# Altium project KitKTS.PrjPcb (part 2 of 3)

## Sheet 09-NORStatusLed.SchDoc
size A4; DocumentNumber: 9; SheetNumber: 9; SheetTotal: 26
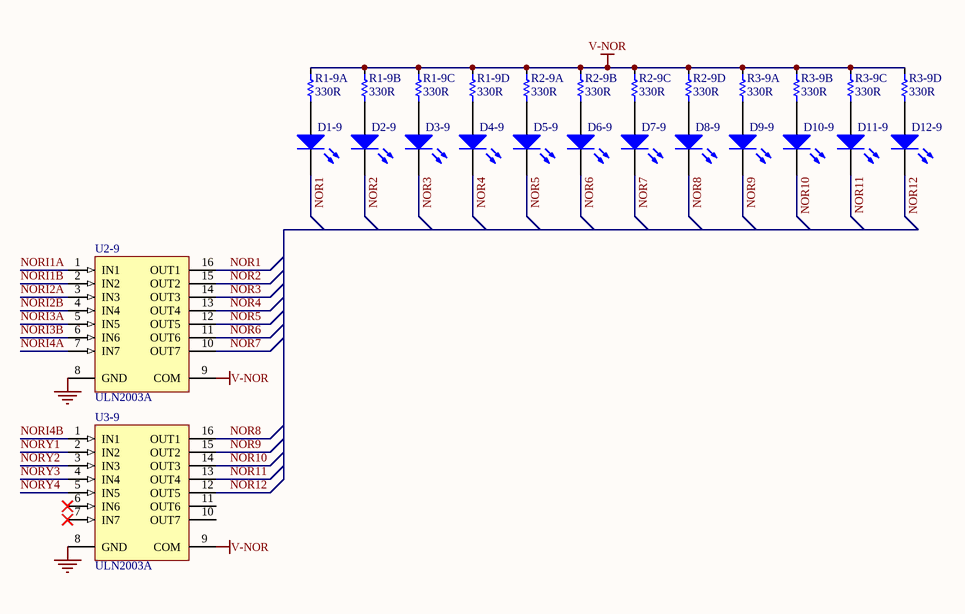
[diagram p15: 09-NORStatusLed.SchDoc]

### Parts
D1-9  LED  [LED-0805]  (value not drawn)
D2-9  LED  [LED-0805]  (value not drawn)
D3-9  LED  [LED-0805]  (value not drawn)
D4-9  LED  [LED-0805]  (value not drawn)
D5-9  LED  [LED-0805]  (value not drawn)
D6-9  LED  [LED-0805]  (value not drawn)
D7-9  LED  [LED-0805]  (value not drawn)
D8-9  LED  [LED-0805]  (value not drawn)
D9-9  LED  [LED-0805]  (value not drawn)
D10-9  LED  [LED-0805]  (value not drawn)
D11-9  LED  [LED-0805]  (value not drawn)
D12-9  LED  [LED-0805]  (value not drawn)
R1-9  330R  [R-Array-0603-4]  (parts A,B,C,D of 4)
R2-9  330R  [R-Array-0603-4]  (parts A,B,C,D of 4)
R3-9  330R  [R-Array-0603-4]  (parts A,B,C,D of 4)
U2-9  ULN2003A  [SOIC-16]
U3-9  ULN2003A  [SOIC-16]

### Nets
GND: U2-9.8(GND) U3-9.8(GND)
V-NOR: R1-9.2 R1-9.4 R1-9.6 R1-9.8 R2-9.2 R2-9.4 R2-9.6 R2-9.8 R3-9.2 R3-9.4 R3-9.6 R3-9.8 U2-9.9(COM) U3-9.9(COM)
NOR1: D1-9.2(K) U2-9.16(OUT1)
NOR2: D2-9.2(K) U2-9.15(OUT2)
NOR3: D3-9.2(K) U2-9.14(OUT3)
NOR4: D4-9.2(K) U2-9.13(OUT4)
NOR5: D5-9.2(K) U2-9.12(OUT5)
NOR6: D6-9.2(K) U2-9.11(OUT6)
NOR7: D7-9.2(K) U2-9.10(OUT7)
NOR8: D8-9.2(K) U3-9.16(OUT1)
NOR9: D9-9.2(K) U3-9.15(OUT2)
NOR10: D10-9.2(K) U3-9.14(OUT3)
NOR11: D11-9.2(K) U3-9.13(OUT4)
NOR12: D12-9.2(K) U3-9.12(OUT5)
NORI1A: U2-9.1(IN1)
NORI1B: U2-9.2(IN2)
NORI2A: U2-9.3(IN3)
NORI2B: U2-9.4(IN4)
NORI3A: U2-9.5(IN5)
NORI3B: U2-9.6(IN6)
NORI4A: U2-9.7(IN7)
NORI4B: U3-9.1(IN1)
NORY1: U3-9.2(IN2)
NORY2: U3-9.3(IN3)
NORY3: U3-9.4(IN4)
NORY4: U3-9.5(IN5)
NetD1-9_1: D1-9.1(A) R1-9.1
NetD2-9_1: D2-9.1(A) R1-9.3
NetD3-9_1: D3-9.1(A) R1-9.5
NetD4-9_1: D4-9.1(A) R1-9.7
NetD5-9_1: D5-9.1(A) R2-9.1
NetD6-9_1: D6-9.1(A) R2-9.3
NetD7-9_1: D7-9.1(A) R2-9.5
NetD8-9_1: D8-9.1(A) R2-9.7
NetD9-9_1: D9-9.1(A) R3-9.1
NetD10-9_1: D10-9.1(A) R3-9.3
NetD11-9_1: D11-9.1(A) R3-9.5
NetD12-9_1: D12-9.1(A) R3-9.7

Not connected (* = marked no-connect by the designer): U3-9 6(IN6)* 7(IN7)* 10(OUT7) 11(OUT6)

### Library data of the parts
D1-9 D2-9 D3-9 D4-9 D5-9 D6-9 D7-9 D8-9 D9-9 D10-9 D11-9 D12-9 = LED2: as D1-4 on sheet 04-ANDStatusLed; Published: 8-Jun-2000; LatestRevisionDate: 17-Jul-2002; LatestRevisionNote: Re-released for DXP Platform.; PackageVersion: Feb-2002; PackageReference: 3.2X1.6X1.1; Publisher: Altium Limited; PackageDescription: SM LED; 2 Flat Leads
R1-9 R2-9 R3-9 = Res Array 4: as R1-4 on sheet 04-ANDStatusLed; Digi-Key Part Number: Y9331TR-ND; Link: http://www.digikey.com/product-detail/en/EXB-38V331JV/Y9331TR-ND/256525
U2-9 U3-9 = ULN2003A: as U1-4 on sheet 04-ANDStatusLed; Published: 13-Oct-2000; LatestRevisionDate: 06-Jun-2005; LatestRevisionNote: Stylized 3D Model Added.; DatasheetVersion: 1998; PackageVersion: 1998; PackageReference: A16; Publisher: Altium Limited; PackageDescription: DIP; 16 Leads; Row Spacing 7.62 mm; Pitch 2.54 mm; Code_JEDEC: MS-001-BB; ComponentLink1Description: Manufacturer Link; ComponentLink1URL: http://www.allegromicro.com/

## Sheet 10-Buffer.SchDoc
size A4; DocumentNumber: 10; SheetNumber: 10; SheetTotal: 26
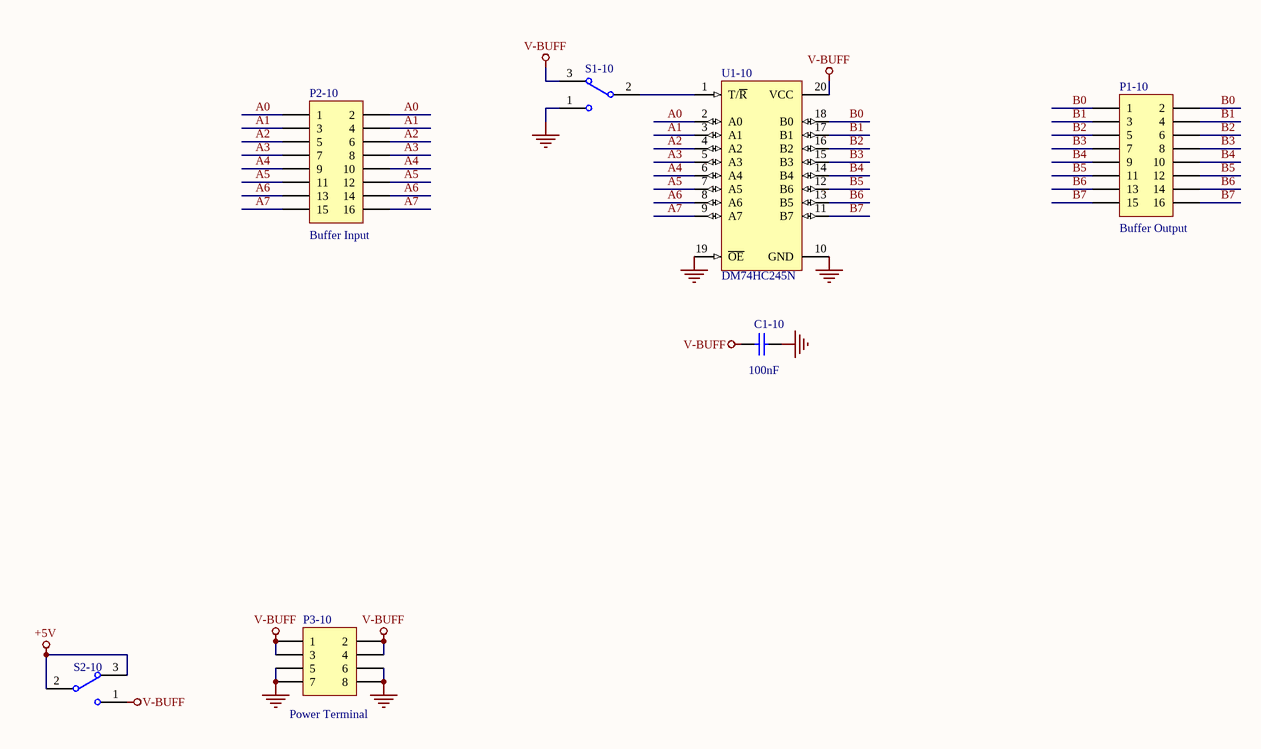
[diagram p16: 10-Buffer.SchDoc]

### Parts
C1-10  value 100nF  [c-0805]  (hidden comment: 104)
P1-10  value Buffer Output  [JP2.54-F-2x08A]  (hidden comment: Header 8X2)
P2-10  value Buffer Input  [JP2.54-F-2x08A]  (hidden comment: Header 8X2)
P3-10  Publisher: Power Terminal  [JP2.54-F-2x04A]  (hidden comment: Header 4X2)
S1-10  SW-SPDT  [SW-SLIDE-2P-2W]  (value not drawn)
S2-10  SW-SPDT  [SW-SLIDE-2P-2W]  (value not drawn)
U1-10  DM74HC245N  [SK-DIP20-300]

### Nets
+5V: S2-10.2 S2-10.3
GND: C1-10.2 P3-10.5 P3-10.6 P3-10.7 P3-10.8 S1-10.1 U1-10.10(GND) U1-10.19(~{OE})
V-BUFF: C1-10.1 P3-10.1 P3-10.2 P3-10.3 P3-10.4 S1-10.3 S2-10.1 U1-10.20(VCC)
A0: P2-10.1 P2-10.2 U1-10.2(A0)
A1: P2-10.3 P2-10.4 U1-10.3(A1)
A2: P2-10.5 P2-10.6 U1-10.4(A2)
A3: P2-10.7 P2-10.8 U1-10.5(A3)
A4: P2-10.9 P2-10.10 U1-10.6(A4)
A5: P2-10.11 P2-10.12 U1-10.7(A5)
A6: P2-10.13 P2-10.14 U1-10.8(A6)
A7: P2-10.15 P2-10.16 U1-10.9(A7)
B0: P1-10.1 P1-10.2 U1-10.18(B0)
B1: P1-10.3 P1-10.4 U1-10.17(B1)
B2: P1-10.5 P1-10.6 U1-10.16(B2)
B3: P1-10.7 P1-10.8 U1-10.15(B3)
B4: P1-10.9 P1-10.10 U1-10.14(B4)
B5: P1-10.11 P1-10.12 U1-10.12(B6)
B6: P1-10.13 P1-10.14 U1-10.13(B5)
B7: P1-10.15 P1-10.16 U1-10.11(B7)
NetS1-10_2: S1-10.2 U1-10.1(T/~{R})

### Library data of the parts
C1-10 = Cap: Capacitor; Published: 8-Jun-2000; LatestRevisionDate: 17-Jul-2002; LatestRevisionNote: Re-released for DXP Platform.; PackageReference: RAD-0.3; Publisher: Altium Limited; PackageDescription: Radial Cap, Thru-Hole; 2 Leads; 0.3 in Pin Spacing
P1-10 P2-10 = Header 8X2: Header, 8-Pin, Dual row; LatestRevisionDate: 17-Jul-2002; LatestRevisionNote: Re-released for DXP Platform.
P3-10 = Header 4X2: Header, 4-Pin, Dual row; LatestRevisionDate: 17-Jul-2002; LatestRevisionNote: Re-released for DXP Platform.
S1-10 S2-10 = SW-SPDT: as S1-2 on sheet 02-PowerSupply; Published: 24-Mar-1999; LatestRevisionDate: 17-Dec-2003; LatestRevisionNote: Schematic revised, PCB Footprint replaced.; DatasheetVersion: 05-Dec-2000; PackageReference: TL36WW15050; Publisher: Altium Limited; PackageDescription: Switch; 4 Leads; ComponentLink1Description: Manufacturer Link; ComponentLink1URL: http://www.apem.com
U1-10 = DM74LS245N: 3-State Octal Bus Transceiver; Published: 17-Jul-2002; LatestRevisionDate: 04-Mar-2005; LatestRevisionNote: Stylized 3D Model Added.; DatasheetVersion: Mar-1998; PackageVersion: 2000; PackageReference: N20A; Publisher: Altium Limited; PackageDescription: DIP, 20-Pin, Row Spacing 7.62 mm, Pitch 2.54 mm; Code_JEDEC: MS-001-AD; ComponentLink1Description: Manufacturer Link; ComponentLink1URL: http://www.fairchildsemi.com/

## Sheet 11-DFlipFlop.SchDoc
size A4; DocumentNumber: 11; SheetNumber: 11; SheetTotal: 26
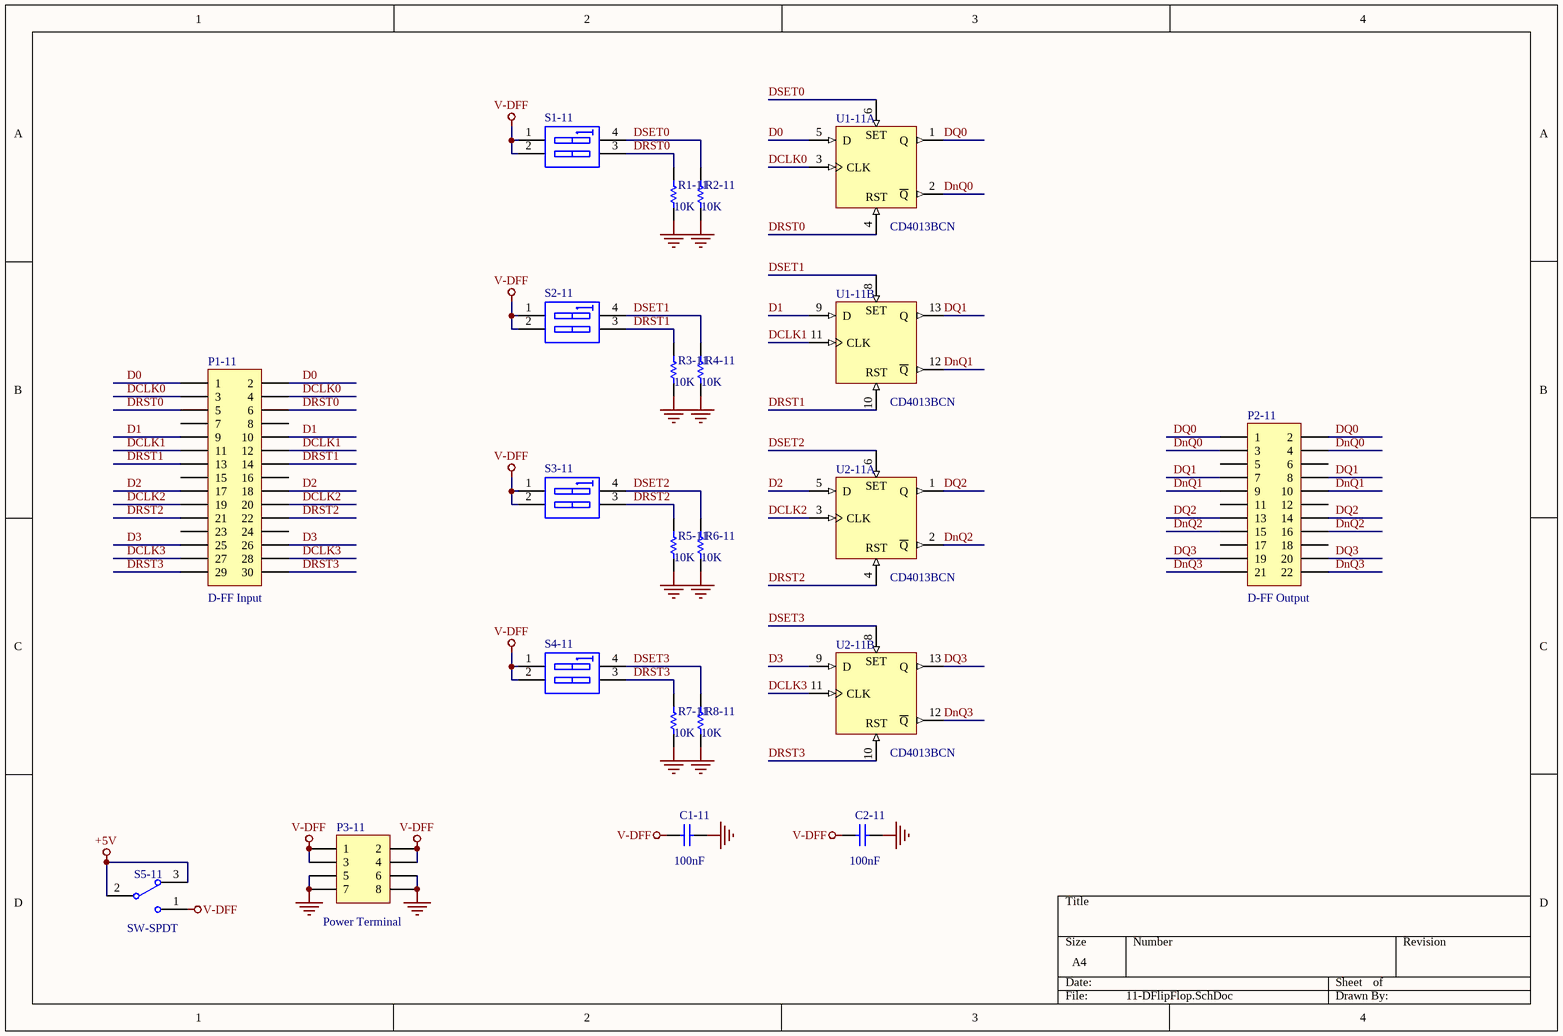
[diagram p17: 11-DFlipFlop.SchDoc]

### Parts
C1-11  value 100nF  [c-0805]  (hidden comment: 104)
C2-11  value 100nF  [c-0805]  (hidden comment: 104)
P1-11  value D-FF Input  [JP2.54-F-2x15A]  (hidden comment: Header 15X2)
P2-11  value D-FF Output  [JP2.54-F-2x11A]  (hidden comment: Header 11X2)
P3-11  Publisher: Power Terminal  [JP2.54-F-2x04A]  (hidden comment: Header 4X2)
R1-11  10K  [R-0805]
R2-11  10K  [R-0805]
R3-11  10K  [R-0805]
R4-11  10K  [R-0805]
R5-11  10K  [R-0805]
R6-11  10K  [R-0805]
R7-11  10K  [R-0805]
R8-11  10K  [R-0805]
S1-11  SW DIP-2  [SW-DIP2-SMD]  (value not drawn)
S2-11  SW DIP-2  [SW-DIP2-SMD]  (value not drawn)
S3-11  SW DIP-2  [SW-DIP2-SMD]  (value not drawn)
S4-11  SW DIP-2  [SW-DIP2-SMD]  (value not drawn)
S5-11  SW-SPDT  [SW-SLIDE-2P-2W]
U1-11  CD4013BCN  [SK-DIP14-300]  (parts A,B of 2)
U2-11  CD4013BCN  [SK-DIP14-300]  (parts A,B of 2)

### Nets
+5V: S5-11.2 S5-11.3
GND: C1-11.2 C2-11.2 P3-11.5 P3-11.6 P3-11.7 P3-11.8 R1-11.1 R2-11.1 R3-11.1 R4-11.1 R5-11.1 R6-11.1 R7-11.1 R8-11.1 U1-11.7(GND) U2-11.7(GND)
V-DFF: C1-11.1 C2-11.1 P3-11.1 P3-11.2 P3-11.3 P3-11.4 S1-11.1(A1) S1-11.2(A2) S2-11.1(A1) S2-11.2(A2) S3-11.1(A1) S3-11.2(A2) S4-11.1(A1) S4-11.2(A2) S5-11.1
VDD: U1-11.14(V-DFF) U2-11.14(V-DFF)
D0: P1-11.1 P1-11.2 U1-11.5(D)
D1: P1-11.9 P1-11.10 U1-11.9(D)
D2: P1-11.17 P1-11.18 U2-11.5(D)
D3: P1-11.25 P1-11.26 U2-11.9(D)
DCLK0: P1-11.3 P1-11.4 U1-11.3(CLK)
DCLK1: P1-11.11 P1-11.12 U1-11.11(CLK)
DCLK2: P1-11.19 P1-11.20 U2-11.3(CLK)
DCLK3: P1-11.27 P1-11.28 U2-11.11(CLK)
DnQ0: P2-11.3 P2-11.4 U1-11.2(~{Q})
DnQ1: P2-11.9 P2-11.10 U1-11.12(~{Q})
DnQ2: P2-11.15 P2-11.16 U2-11.2(~{Q})
DnQ3: P2-11.21 P2-11.22 U2-11.12(~{Q})
DQ0: P2-11.1 P2-11.2 U1-11.1(Q)
DQ1: P2-11.7 P2-11.8 U1-11.13(Q)
DQ2: P2-11.13 P2-11.14 U2-11.1(Q)
DQ3: P2-11.19 P2-11.20 U2-11.13(Q)
DRST0: P1-11.5 P1-11.6 R1-11.2 S1-11.3(B2) U1-11.4(RST)
DRST1: P1-11.13 P1-11.14 R3-11.2 S2-11.3(B2) U1-11.10(RST)
DRST2: P1-11.21 P1-11.22 R5-11.2 S3-11.3(B2) U2-11.4(RST)
DRST3: P1-11.29 P1-11.30 R7-11.2 S4-11.3(B2) U2-11.10(RST)
DSET0: R2-11.2 S1-11.4(B1) U1-11.6(S)
DSET1: R4-11.2 S2-11.4(B1) U1-11.8(S)
DSET2: R6-11.2 S3-11.4(B1) U2-11.6(S)
DSET3: R8-11.2 S4-11.4(B1) U2-11.8(S)

Not connected (* = marked no-connect by the designer): P1-11 7 8 15 16 23 24; P2-11 5 6 11 12 17 18

### Notes on the sheet
- (in symbol CD4013BCN, part A) SET
- (in symbol CD4013BCN, part B) SET

### Library data of the parts
C1-11 C2-11 = Cap: Capacitor; Published: 8-Jun-2000; LatestRevisionDate: 17-Jul-2002; LatestRevisionNote: Re-released for DXP Platform.; PackageReference: RAD-0.3; Publisher: Altium Limited; PackageDescription: Radial Cap, Thru-Hole; 2 Leads; 0.3 in Pin Spacing
P1-11 = Header 15X2: Header, 15-Pin, Dual row; LatestRevisionDate: 17-Jul-2002; LatestRevisionNote: Re-released for DXP Platform.
P2-11 = Header 11X2: Header, 11-Pin, Dual row; LatestRevisionDate: 17-Jul-2002; LatestRevisionNote: Re-released for DXP Platform.
P3-11 = Header 4X2: Header, 4-Pin, Dual row; LatestRevisionDate: 17-Jul-2002; LatestRevisionNote: Re-released for DXP Platform.
R1-11 R2-11 R3-11 R4-11 R5-11 R6-11 R7-11 R8-11 = Res1: Resistor; Published: 8-Jun-2000; LatestRevisionDate: 17-Jul-2002; LatestRevisionNote: Re-released for DXP Platform.; PackageReference: AXIAL-0.3; Publisher: Altium Limited; PackageDescription: Axial Device, Thru-Hole; 2 Leads; 0.3 in Pin Spacing; Value: 10K
S1-11 S2-11 S3-11 S4-11 = SW DIP-2: DIP Switch, 2 Position, SPST; Published: 24-Mar-1999; LatestRevisionDate: 17-Jul-2002; LatestRevisionNote: Re-released for DXP Platform.; PackageReference: DIP-4; Publisher: Altium Limited
S5-11 = SW-SPDT: as S1-2 on sheet 02-PowerSupply; Published: 24-Mar-1999; LatestRevisionDate: 17-Dec-2003; LatestRevisionNote: Schematic revised, PCB Footprint replaced.; DatasheetVersion: 05-Dec-2000; PackageReference: TL36WW15050; Publisher: Altium Limited; PackageDescription: Switch; 4 Leads; ComponentLink1Description: Manufacturer Link; ComponentLink1URL: http://www.apem.com
U1-11 U2-11 = CD4013BCN: Dual D-Type Flip-Flop; Published: 17-Jul-2002; LatestRevisionDate: 29-May-2009; LatestRevisionNote: Component Body Added.; DatasheetVersion: Jan-1999; PackageVersion: 2000; PackageReference: N14A; Publisher: Altium Limited; PackageDescription: DIP, 14-Pin, Row Spacing 7.62 mm, Pitch 2.54 mm; ComponentLink1Description: Manufacturer Link; ComponentLink1URL: http://www.fairchildsemi.com/

## Sheet 12-JKFlipFlop.SchDoc
size A4; DocumentNumber: 12; SheetNumber: 12; SheetTotal: 26
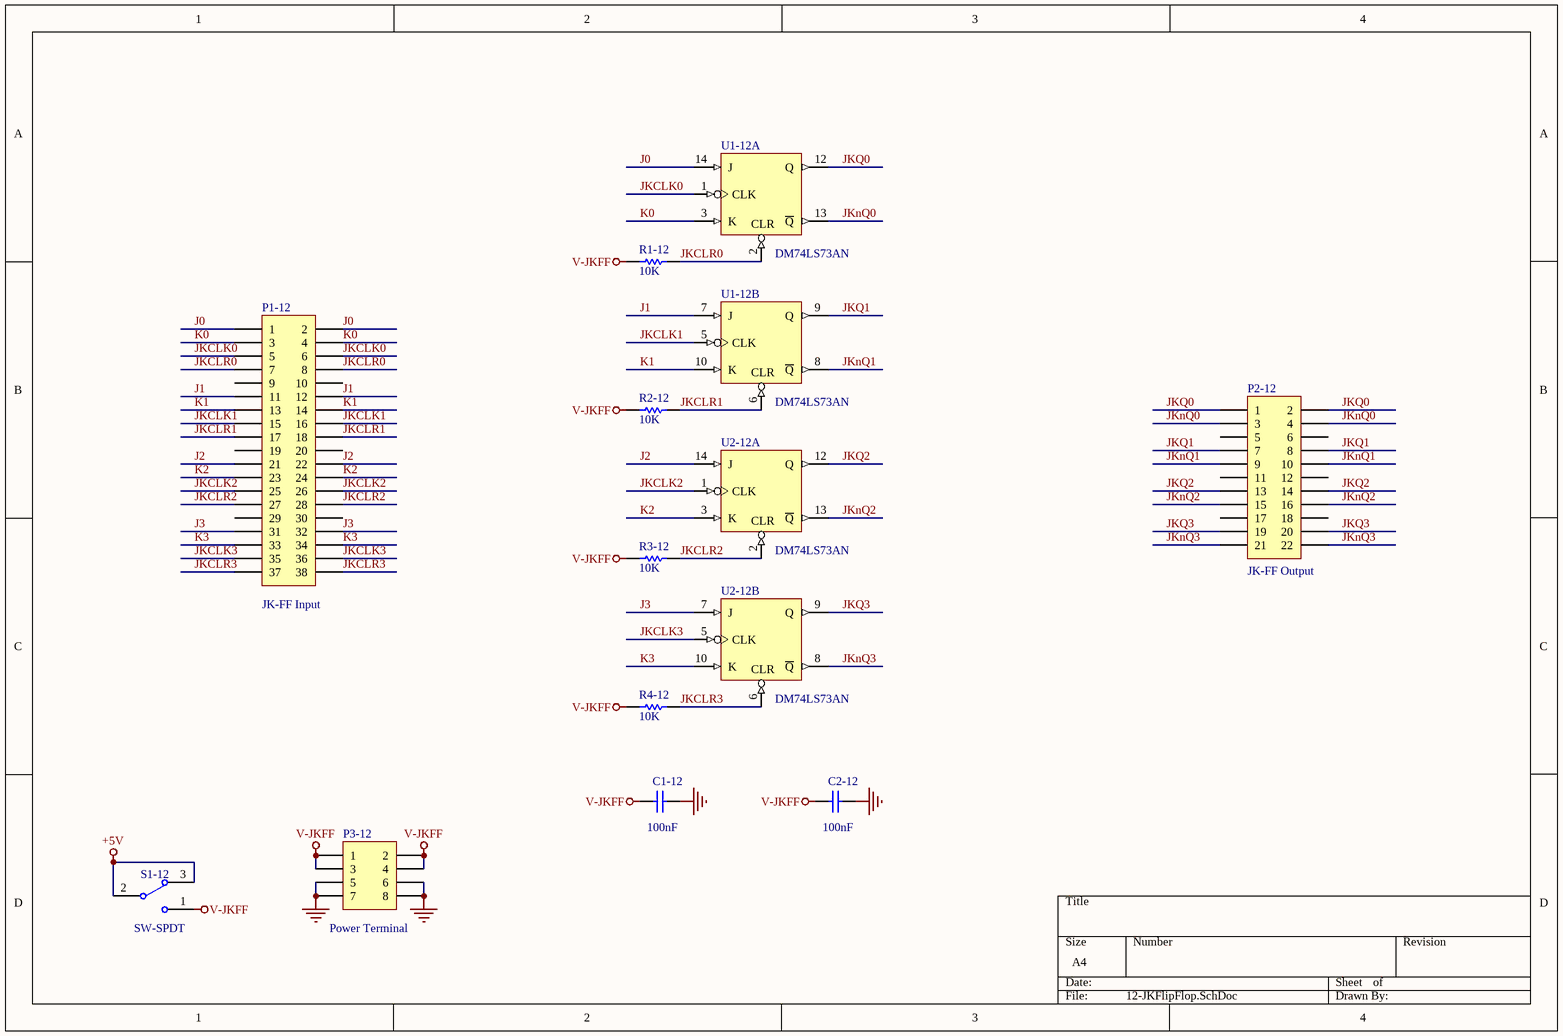
[diagram p18: 12-JKFlipFlop.SchDoc]

### Parts
C1-12  value 100nF  [c-0805]  (hidden comment: 104)
C2-12  value 100nF  [c-0805]  (hidden comment: 104)
P1-12  value JK-FF Input  [JP2.54-F-2x19A]  (hidden comment: Header 19X2)
P2-12  value JK-FF Output  [JP2.54-F-2x11A]  (hidden comment: Header 11X2)
P3-12  Publisher: Power Terminal  [JP2.54-F-2x04A]  (hidden comment: Header 4X2)
R1-12  10K  [R-0805]
R2-12  10K  [R-0805]
R3-12  10K  [R-0805]
R4-12  10K  [R-0805]
S1-12  SW-SPDT  [SW-SLIDE-2P-2W]
U1-12  DM74LS73AN  [SK-DIP14-300]  (parts A,B of 2)
U2-12  DM74LS73AN  [SK-DIP14-300]  (parts A,B of 2)

### Nets
+5V: S1-12.2 S1-12.3
GND: C1-12.2 C2-12.2 P3-12.5 P3-12.6 P3-12.7 P3-12.8 U1-12.11(GND) U2-12.11(GND)
V-JKFF: C1-12.1 C2-12.1 P3-12.1 P3-12.2 P3-12.3 P3-12.4 R1-12.2 R2-12.2 R3-12.2 R4-12.2 S1-12.1
VCC: U1-12.4(V-JKFF) U2-12.4(V-JKFF)
J0: P1-12.1 P1-12.2 U1-12.14(J)
J1: P1-12.11 P1-12.12 U1-12.7(J)
J2: P1-12.21 P1-12.22 U2-12.14(J)
J3: P1-12.31 P1-12.32 U2-12.7(J)
JKCLK0: P1-12.5 P1-12.6 U1-12.1(CLK)
JKCLK1: P1-12.15 P1-12.16 U1-12.5(CLK)
JKCLK2: P1-12.25 P1-12.26 U2-12.1(CLK)
JKCLK3: P1-12.35 P1-12.36 U2-12.5(CLK)
JKCLR0: P1-12.7 P1-12.8 R1-12.1 U1-12.2(CLR)
JKCLR1: P1-12.17 P1-12.18 R2-12.1 U1-12.6(CLR)
JKCLR2: P1-12.27 P1-12.28 R3-12.1 U2-12.2(CLR)
JKCLR3: P1-12.37 P1-12.38 R4-12.1 U2-12.6(CLR)
JKnQ0: P2-12.3 P2-12.4 U1-12.13(~{Q})
JKnQ1: P2-12.9 P2-12.10 U1-12.8(~{Q})
JKnQ2: P2-12.15 P2-12.16 U2-12.13(~{Q})
JKnQ3: P2-12.21 P2-12.22 U2-12.8(~{Q})
JKQ0: P2-12.1 P2-12.2 U1-12.12(Q)
JKQ1: P2-12.7 P2-12.8 U1-12.9(Q)
JKQ2: P2-12.13 P2-12.14 U2-12.12(Q)
JKQ3: P2-12.19 P2-12.20 U2-12.9(Q)
K0: P1-12.3 P1-12.4 U1-12.3(K)
K1: P1-12.13 P1-12.14 U1-12.10(K)
K2: P1-12.23 P1-12.24 U2-12.3(K)
K3: P1-12.33 P1-12.34 U2-12.10(K)

Not connected (* = marked no-connect by the designer): P1-12 9 10 19 20 29 30; P2-12 5 6 11 12 17 18

### Library data of the parts
C1-12 C2-12 = Cap: Capacitor; Published: 8-Jun-2000; LatestRevisionDate: 17-Jul-2002; LatestRevisionNote: Re-released for DXP Platform.; PackageReference: RAD-0.3; Publisher: Altium Limited; PackageDescription: Radial Cap, Thru-Hole; 2 Leads; 0.3 in Pin Spacing
P1-12 = Header 19X2: Header, 19-Pin, Dual row; LatestRevisionDate: 17-Jul-2002; LatestRevisionNote: Re-released for DXP Platform.
P2-12 = Header 11X2: Header, 11-Pin, Dual row; LatestRevisionDate: 17-Jul-2002; LatestRevisionNote: Re-released for DXP Platform.
P3-12 = Header 4X2: Header, 4-Pin, Dual row; LatestRevisionDate: 17-Jul-2002; LatestRevisionNote: Re-released for DXP Platform.
R1-12 R2-12 R3-12 R4-12 = Res1: Resistor; Published: 8-Jun-2000; LatestRevisionDate: 17-Jul-2002; LatestRevisionNote: Re-released for DXP Platform.; PackageReference: AXIAL-0.3; Publisher: Altium Limited; PackageDescription: Axial Device, Thru-Hole; 2 Leads; 0.3 in Pin Spacing; Value: 10K
S1-12 = SW-SPDT: as S1-2 on sheet 02-PowerSupply; Published: 24-Mar-1999; LatestRevisionDate: 17-Dec-2003; LatestRevisionNote: Schematic revised, PCB Footprint replaced.; DatasheetVersion: 05-Dec-2000; PackageReference: TL36WW15050; Publisher: Altium Limited; PackageDescription: Switch; 4 Leads; ComponentLink1Description: Manufacturer Link; ComponentLink1URL: http://www.apem.com
U1-12 U2-12 = DM74LS73AN: Dual Negative-Edge-Triggered Master-Slave J-K Flip-Flop with Clear and Complementary Output; Published: 17-Jul-2002; LatestRevisionDate: 29-May-2009; LatestRevisionNote: Component Body Added.; DatasheetVersion: Mar-1998; PackageVersion: 2000; PackageReference: N14A; Publisher: Altium Limited; PackageDescription: DIP, 14-Pin, Row Spacing 7.62 mm, Pitch 2.54 mm; ComponentLink1Description: Manufacturer Link; ComponentLink1URL: http://www.fairchildsemi.com/

## Sheet 13-Counter74LS90.SchDoc
size A4; DocumentNumber: 13; SheetNumber: 13; SheetTotal: 26
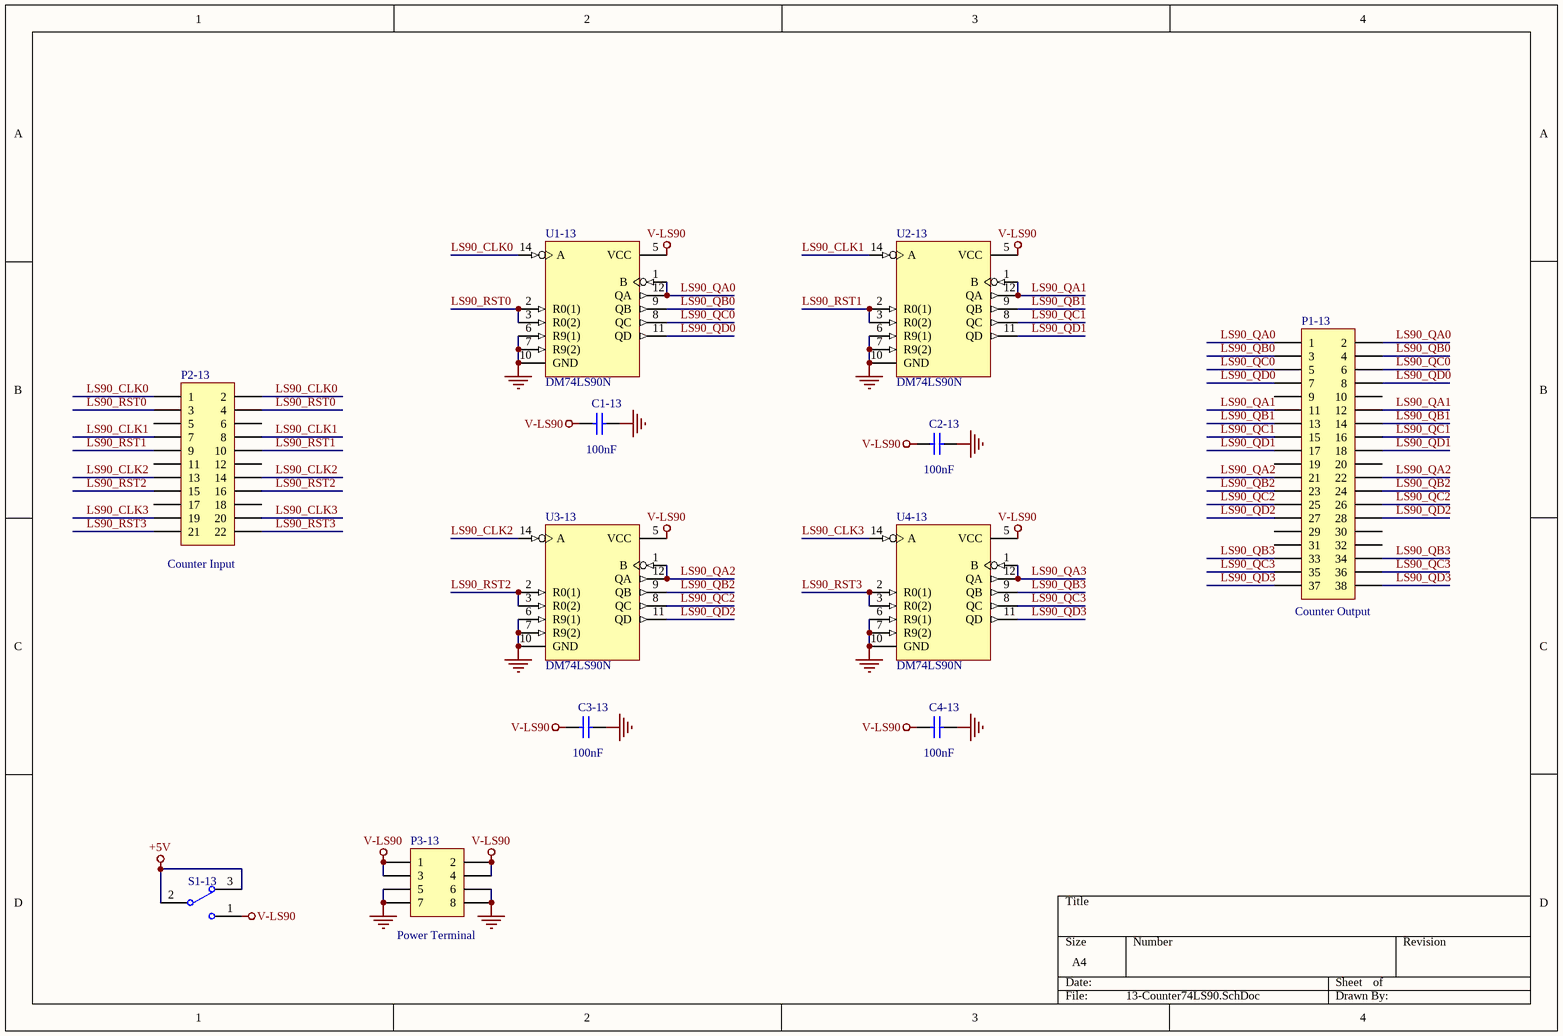
[diagram p19: 13-Counter74LS90.SchDoc]

### Parts
C1-13  value 100nF  [c-0805]  (hidden comment: 104)
C2-13  value 100nF  [c-0805]  (hidden comment: 104)
C3-13  value 100nF  [c-0805]  (hidden comment: 104)
C4-13  value 100nF  [c-0805]  (hidden comment: 104)
P1-13  value Counter Output  [JP2.54-F-2x19A]  (hidden comment: Header 19X2)
P2-13  value Counter Input  [JP2.54-F-2x11A]  (hidden comment: Header 11X2)
P3-13  Publisher: Power Terminal  [JP2.54-F-2x04A]  (hidden comment: Header 4X2)
S1-13  SW-SPDT  [SW-SLIDE-2P-2W]  (value not drawn)
U1-13  DM74LS90N  [SK-DIP14-300]
U2-13  DM74LS90N  [SK-DIP14-300]
U3-13  DM74LS90N  [SK-DIP14-300]
U4-13  DM74LS90N  [SK-DIP14-300]

### Nets
+5V: S1-13.2 S1-13.3
GND: C1-13.2 C2-13.2 C3-13.2 C4-13.2 P3-13.5 P3-13.6 P3-13.7 P3-13.8 U1-13.6(R9(1)) U1-13.7(R9(2)) U1-13.10(GND) U2-13.6(R9(1)) U2-13.7(R9(2)) U2-13.10(GND) U3-13.6(R9(1)) U3-13.7(R9(2)) U3-13.10(GND) U4-13.6(R9(1)) U4-13.7(R9(2)) U4-13.10(GND)
V-LS90: C1-13.1 C2-13.1 C3-13.1 C4-13.1 P3-13.1 P3-13.2 P3-13.3 P3-13.4 S1-13.1 U1-13.5(VCC) U2-13.5(VCC) U3-13.5(VCC) U4-13.5(VCC)
LS90_CLK0: P2-13.1 P2-13.2 U1-13.14(A)
LS90_CLK1: P2-13.7 P2-13.8 U2-13.14(A)
LS90_CLK2: P2-13.13 P2-13.14 U3-13.14(A)
LS90_CLK3: P2-13.19 P2-13.20 U4-13.14(A)
LS90_QA0: P1-13.1 P1-13.2 U1-13.1(B) U1-13.12(QA)
LS90_QA1: P1-13.11 P1-13.12 U2-13.1(B) U2-13.12(QA)
LS90_QA2: P1-13.21 P1-13.22 U3-13.1(B) U3-13.12(QA)
LS90_QA3: U4-13.1(B) U4-13.12(QA)
LS90_QB0: P1-13.3 P1-13.4 U1-13.9(QB)
LS90_QB1: P1-13.13 P1-13.14 U2-13.9(QB)
LS90_QB2: P1-13.23 P1-13.24 U3-13.9(QB)
LS90_QB3: P1-13.33 P1-13.34 U4-13.9(QB)
LS90_QC0: P1-13.5 P1-13.6 U1-13.8(QC)
LS90_QC1: P1-13.15 P1-13.16 U2-13.8(QC)
LS90_QC2: P1-13.25 P1-13.26 U3-13.8(QC)
LS90_QC3: P1-13.35 P1-13.36 U4-13.8(QC)
LS90_QD0: P1-13.7 P1-13.8 U1-13.11(QD)
LS90_QD1: P1-13.17 P1-13.18 U2-13.11(QD)
LS90_QD2: P1-13.27 P1-13.28 U3-13.11(QD)
LS90_QD3: P1-13.37 P1-13.38 U4-13.11(QD)
LS90_RST0: P2-13.3 P2-13.4 U1-13.2(R0(1)) U1-13.3(R0(2))
LS90_RST1: P2-13.9 P2-13.10 U2-13.2(R0(1)) U2-13.3(R0(2))
LS90_RST2: P2-13.15 P2-13.16 U3-13.2(R0(1)) U3-13.3(R0(2))
LS90_RST3: P2-13.21 P2-13.22 U4-13.2(R0(1)) U4-13.3(R0(2))

Not connected (* = marked no-connect by the designer): P1-13 9 10 19 20 29 30 31 32; P2-13 5 6 11 12 17 18

### Library data of the parts
C1-13 C2-13 C3-13 C4-13 = Cap: Capacitor; Published: 8-Jun-2000; LatestRevisionDate: 17-Jul-2002; LatestRevisionNote: Re-released for DXP Platform.; PackageReference: RAD-0.3; Publisher: Altium Limited; PackageDescription: Radial Cap, Thru-Hole; 2 Leads; 0.3 in Pin Spacing
P1-13 = Header 19X2: Header, 19-Pin, Dual row; LatestRevisionDate: 17-Jul-2002; LatestRevisionNote: Re-released for DXP Platform.
P2-13 = Header 11X2: Header, 11-Pin, Dual row; LatestRevisionDate: 17-Jul-2002; LatestRevisionNote: Re-released for DXP Platform.
P3-13 = Header 4X2: Header, 4-Pin, Dual row; LatestRevisionDate: 17-Jul-2002; LatestRevisionNote: Re-released for DXP Platform.
S1-13 = SW-SPDT: as S1-2 on sheet 02-PowerSupply; Published: 24-Mar-1999; LatestRevisionDate: 17-Dec-2003; LatestRevisionNote: Schematic revised, PCB Footprint replaced.; DatasheetVersion: 05-Dec-2000; PackageReference: TL36WW15050; Publisher: Altium Limited; PackageDescription: Switch; 4 Leads; ComponentLink1Description: Manufacturer Link; ComponentLink1URL: http://www.apem.com
U1-13 U2-13 U3-13 U4-13 = DM74LS90N: Decade and Binary Counter; Note: NC pins 4 and 13 are not drawn.; Published: 17-Jul-2002; LatestRevisionDate: 29-May-2009; LatestRevisionNote: Component Body Added.; DatasheetVersion: Mar-1998; PackageVersion: 2000; PackageReference: N14A; Publisher: Altium Limited; PackageDescription: DIP, 14-Pin, Row Spacing 7.62 mm, Pitch 2.54 mm; ComponentLink1Description: Manufacturer Link; ComponentLink1URL: http://www.fairchildsemi.com/

## Sheet 14-Counter74LS192.SchDoc
size A4; DocumentNumber: 14; SheetNumber: 14; SheetTotal: 26
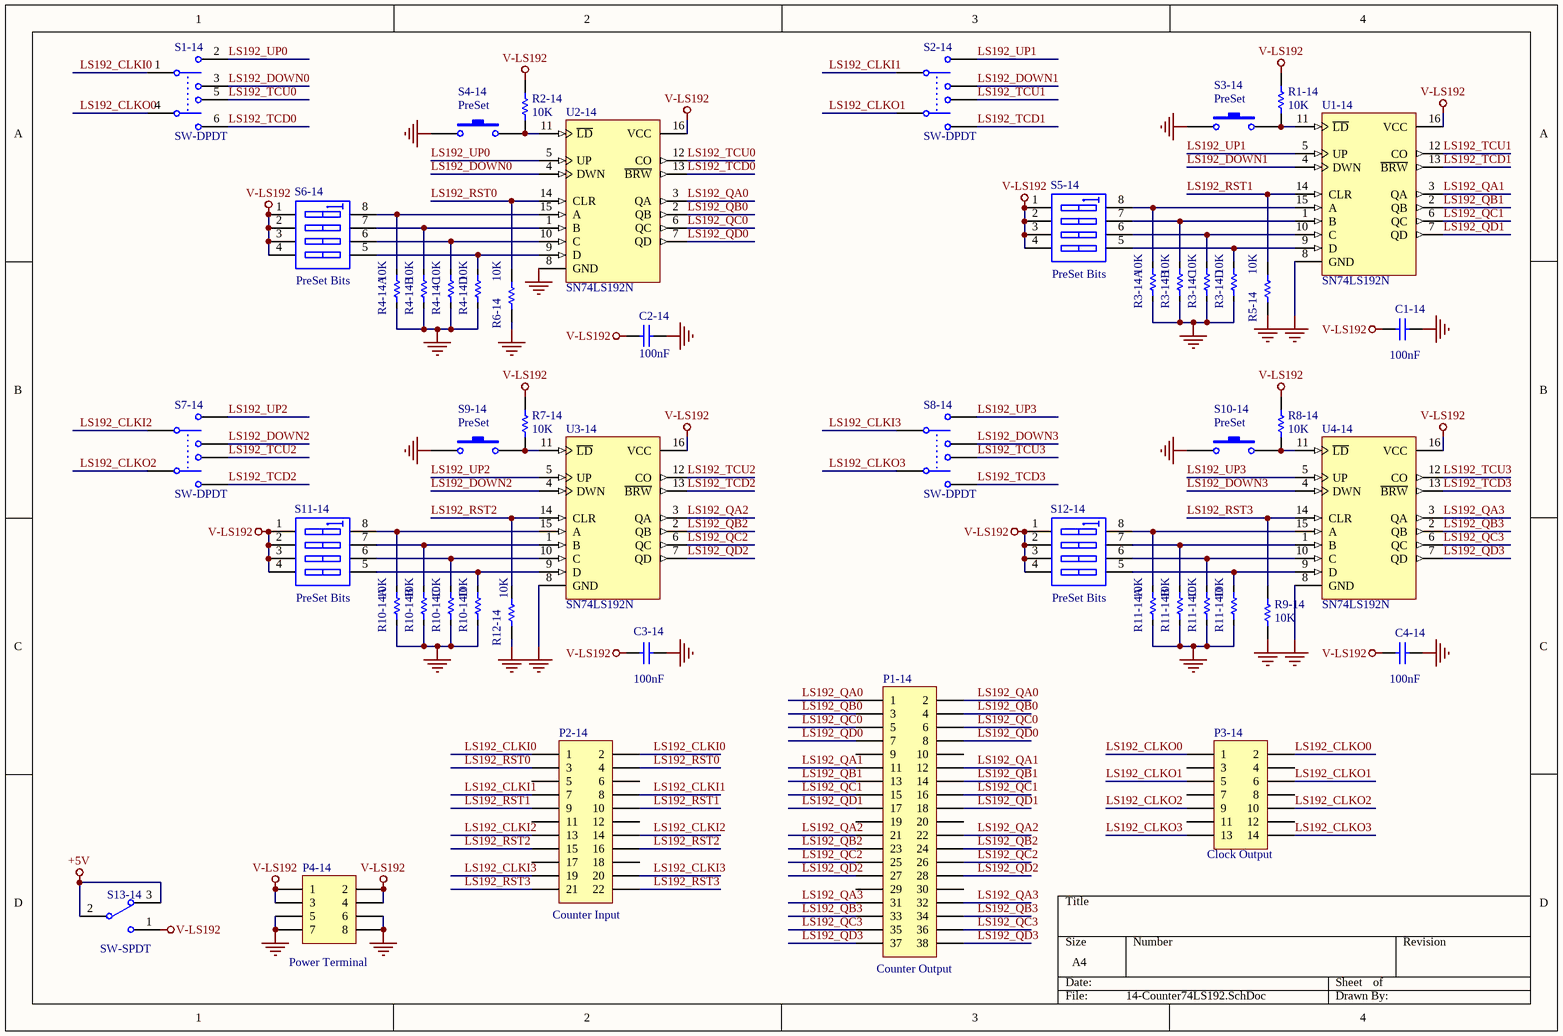
[diagram p20: 14-Counter74LS192.SchDoc]

### Parts
C1-14  value 100nF  [c-0805]  (hidden comment: 104)
C2-14  value 100nF  [c-0805]  (hidden comment: 104)
C3-14  value 100nF  [c-0805]  (hidden comment: 104)
C4-14  value 100nF  [c-0805]  (hidden comment: 104)
P1-14  value Counter Output  [JP2.54-F-2x19A]  (hidden comment: Header 19X2)
P2-14  value Counter Input  [JP2.54-F-2x11A]  (hidden comment: Header 11X2)
P3-14  value Clock Output  [JP2.54-F-2x07A]  (hidden comment: Header 7X2)
P4-14  Publisher: Power Terminal  [JP2.54-F-2x04A]  (hidden comment: Header 4X2)
R1-14  10K  [R-0805]
R2-14  10K  [R-0805]
R3-14  10K  [R-Array-0603-4]  (parts A,B,C,D of 4)
R4-14  10K  [R-Array-0603-4]  (parts A,B,C,D of 4)
R5-14  10K  [R-0805]
R6-14  10K  [R-0805]
R7-14  10K  [R-0805]
R8-14  10K  [R-0805]
R9-14  10K  [R-0805]
R10-14  10K  [R-Array-0603-4]  (parts A,B,C,D of 4)
R11-14  10K  [R-Array-0603-4]  (parts A,B,C,D of 4)
R12-14  10K  [R-0805]
S1-14  SW-DPDT  [DPDT-6]
S2-14  SW-DPDT  [DPDT-6]
S3-14  value PreSet  [SW-T-S6-SMD]  (hidden comment: SW-S6)
S4-14  value PreSet  [SW-T-S6-SMD]  (hidden comment: SW-S6)
S5-14  value PreSet Bits  [SW-DIP4-SMD]  (hidden comment: SW DIP-4)
S6-14  value PreSet Bits  [SW-DIP4-SMD]  (hidden comment: SW DIP-4)
S7-14  SW-DPDT  [DPDT-6]
S8-14  SW-DPDT  [DPDT-6]
S9-14  value PreSet  [SW-T-S6-SMD]  (hidden comment: SW-S6)
S10-14  value PreSet  [SW-T-S6-SMD]  (hidden comment: SW-S6)
S11-14  value PreSet Bits  [SW-DIP4-SMD]  (hidden comment: SW DIP-4)
S12-14  value PreSet Bits  [SW-DIP4-SMD]  (hidden comment: SW DIP-4)
S13-14  SW-SPDT  [SW-SLIDE-2P-2W]
U1-14  SN74LS192N  [SK-DIP16-300]
U2-14  SN74LS192N  [SK-DIP16-300]
U3-14  SN74LS192N  [SK-DIP16-300]
U4-14  SN74LS192N  [SK-DIP16-300]

### Nets
+5V: S13-14.2 S13-14.3
GND: C1-14.2 C2-14.2 C3-14.2 C4-14.2 P4-14.5 P4-14.6 P4-14.7 P4-14.8 R3-14.1 R3-14.3 R3-14.5 R3-14.7 R4-14.1 R4-14.3 R4-14.5 R4-14.7 R5-14.1 R6-14.1 R9-14.1 R10-14.1 R10-14.3 R10-14.5 R10-14.7 R11-14.1 R11-14.3 R11-14.5 R11-14.7 R12-14.1 S3-14.1 S4-14.1 S9-14.1 S10-14.1 U1-14.8(GND) U2-14.8(GND) U3-14.8(GND) U4-14.8(GND)
V-LS192: C1-14.1 C2-14.1 C3-14.1 C4-14.1 P4-14.1 P4-14.2 P4-14.3 P4-14.4 R1-14.2 R2-14.2 R7-14.2 R8-14.2 S5-14.1(A1) S5-14.2(A2) S5-14.3(A3) S5-14.4(A4) S6-14.1(A1) S6-14.2(A2) S6-14.3(A3) S6-14.4(A4) S11-14.1(A1) S11-14.2(A2) S11-14.3(A3) S11-14.4(A4) S12-14.1(A1) S12-14.2(A2) S12-14.3(A3) S12-14.4(A4) S13-14.1 U1-14.16(VCC) U2-14.16(VCC) U3-14.16(VCC) U4-14.16(VCC)
LS192_CLKI0: P2-14.1 P2-14.2 S1-14.1
LS192_CLKI1: P2-14.7 P2-14.8 S2-14.1
LS192_CLKI2: P2-14.13 P2-14.14 S7-14.1
LS192_CLKI3: P2-14.19 P2-14.20 S8-14.1
LS192_CLKO0: P3-14.1 P3-14.2 S1-14.4
LS192_CLKO1: P3-14.5 P3-14.6 S2-14.4
LS192_CLKO2: P3-14.9 P3-14.10 S7-14.4
LS192_CLKO3: P3-14.13 P3-14.14 S8-14.4
LS192_DOWN0: S1-14.3 U2-14.4(DWN)
LS192_DOWN1: S2-14.3 U1-14.4(DWN)
LS192_DOWN2: S7-14.3 U3-14.4(DWN)
LS192_DOWN3: S8-14.3 U4-14.4(DWN)
LS192_QA0: P1-14.1 P1-14.2 U2-14.3(QA)
LS192_QA1: P1-14.11 P1-14.12 U1-14.3(QA)
LS192_QA2: P1-14.21 P1-14.22 U3-14.3(QA)
LS192_QA3: P1-14.31 P1-14.32 U4-14.3(QA)
LS192_QB0: P1-14.3 P1-14.4 U2-14.2(QB)
LS192_QB1: P1-14.13 P1-14.14 U1-14.2(QB)
LS192_QB2: P1-14.23 P1-14.24 U3-14.2(QB)
LS192_QB3: P1-14.33 P1-14.34 U4-14.2(QB)
LS192_QC0: P1-14.5 P1-14.6 U2-14.6(QC)
LS192_QC1: P1-14.15 P1-14.16 U1-14.6(QC)
LS192_QC2: P1-14.25 P1-14.26 U3-14.6(QC)
LS192_QC3: P1-14.35 P1-14.36 U4-14.6(QC)
LS192_QD0: P1-14.7 P1-14.8 U2-14.7(QD)
LS192_QD1: P1-14.17 P1-14.18 U1-14.7(QD)
LS192_QD2: P1-14.27 P1-14.28 U3-14.7(QD)
LS192_QD3: P1-14.37 P1-14.38 U4-14.7(QD)
LS192_RST0: P2-14.3 P2-14.4 R6-14.2 U2-14.14(CLR)
LS192_RST1: P2-14.9 P2-14.10 R5-14.2 U1-14.14(CLR)
LS192_RST2: P2-14.15 P2-14.16 R12-14.2 U3-14.14(CLR)
LS192_RST3: P2-14.21 P2-14.22 R9-14.2 U4-14.14(CLR)
LS192_TCD0: S1-14.6 U2-14.13(~{BRW})
LS192_TCD1: S2-14.6 U1-14.13(~{BRW})
LS192_TCD2: S7-14.6 U3-14.13(~{BRW})
LS192_TCD3: S8-14.6 U4-14.13(~{BRW})
LS192_TCU0: S1-14.5 U2-14.12(CO)
LS192_TCU1: S2-14.5 U1-14.12(CO)
LS192_TCU2: S7-14.5 U3-14.12(CO)
LS192_TCU3: S8-14.5 U4-14.12(CO)
LS192_UP0: S1-14.2 U2-14.5(UP)
LS192_UP1: S2-14.2 U1-14.5(UP)
LS192_UP2: S7-14.2 U3-14.5(UP)
LS192_UP3: S8-14.2 U4-14.5(UP)
NetR1-14_1: R1-14.1 S3-14.2 U1-14.11(~{LD})
NetR2-14_1: R2-14.1 S4-14.2 U2-14.11(~{LD})
NetR3-14_2: R3-14.2 S5-14.8(B1) U1-14.15(A)
NetR3-14_4: R3-14.4 S5-14.7(B2) U1-14.1(B)
NetR3-14_6: R3-14.6 S5-14.6(B3) U1-14.10(C)
NetR3-14_8: R3-14.8 S5-14.5(B4) U1-14.9(D)
NetR4-14_2: R4-14.2 S6-14.8(B1) U2-14.15(A)
NetR4-14_4: R4-14.4 S6-14.7(B2) U2-14.1(B)
NetR4-14_6: R4-14.6 S6-14.6(B3) U2-14.10(C)
NetR4-14_8: R4-14.8 S6-14.5(B4) U2-14.9(D)
NetR7-14_1: R7-14.1 S9-14.2 U3-14.11(~{LD})
NetR8-14_1: R8-14.1 S10-14.2 U4-14.11(~{LD})
NetR10-14_2: R10-14.2 S11-14.8(B1) U3-14.15(A)
NetR10-14_4: R10-14.4 S11-14.7(B2) U3-14.1(B)
NetR10-14_6: R10-14.6 S11-14.6(B3) U3-14.10(C)
NetR10-14_8: R10-14.8 S11-14.5(B4) U3-14.9(D)
NetR11-14_2: R11-14.2 S12-14.8(B1) U4-14.15(A)
NetR11-14_4: R11-14.4 S12-14.7(B2) U4-14.1(B)
NetR11-14_6: R11-14.6 S12-14.6(B3) U4-14.10(C)
NetR11-14_8: R11-14.8 S12-14.5(B4) U4-14.9(D)

Not connected (* = marked no-connect by the designer): P1-14 9 10 19 20 29 30; P2-14 5 6 11 12 17 18; P3-14 3 4 7 8 11 12

### Library data of the parts
C1-14 C2-14 C3-14 C4-14 = Cap: Capacitor; Published: 8-Jun-2000; LatestRevisionDate: 17-Jul-2002; LatestRevisionNote: Re-released for DXP Platform.; PackageReference: RAD-0.3; Publisher: Altium Limited; PackageDescription: Radial Cap, Thru-Hole; 2 Leads; 0.3 in Pin Spacing
P1-14 = Header 19X2: Header, 19-Pin, Dual row; LatestRevisionDate: 17-Jul-2002; LatestRevisionNote: Re-released for DXP Platform.
P2-14 = Header 11X2: Header, 11-Pin, Dual row; LatestRevisionDate: 17-Jul-2002; LatestRevisionNote: Re-released for DXP Platform.
P3-14 = Header 7X2: Header, 7-Pin, Dual row; LatestRevisionDate: 17-Jul-2002; LatestRevisionNote: Re-released for DXP Platform.
P4-14 = Header 4X2: Header, 4-Pin, Dual row; LatestRevisionDate: 17-Jul-2002; LatestRevisionNote: Re-released for DXP Platform.
R1-14 R2-14 R5-14 R6-14 R7-14 R8-14 R9-14 R12-14 = Res1: Resistor; Published: 8-Jun-2000; LatestRevisionDate: 17-Jul-2002; LatestRevisionNote: Re-released for DXP Platform.; PackageReference: AXIAL-0.3; Publisher: Altium Limited; PackageDescription: Axial Device, Thru-Hole; 2 Leads; 0.3 in Pin Spacing; Value: 10K
R3-14 R4-14 R10-14 R11-14 = R-8P4R: RES ARRAY 4 RES 330 OHM 1206; Manufacturer: Panasonic Electronic Components; Manufacturer Part Number: EXB-38V331JV; Digi-Key Part Number: Y9331TR-ND; Link: http://www.digikey.com/product-detail/en/EXB-38V331JV/Y9331TR-ND/256525
S1-14 S2-14 S7-14 S8-14 = SW-DPDT: Double-Pole, Double-Throw Switch; Published: 24-Mar-1999; LatestRevisionDate: 17-Jul-2002; LatestRevisionNote: Re-released for DXP Platform.; PackageReference: DPDT-6; Publisher: Altium Limited
S3-14 S4-14 S9-14 S10-14 = SW-PB: Switch; Published: 24-Mar-1999; LatestRevisionDate: 17-Jul-2002; LatestRevisionNote: Re-released for DXP Platform.; PackageReference: SPST-2
S5-14 S6-14 S11-14 S12-14 = SW DIP-4: DIP Switch, 4 Position, SPST; Published: 24-Mar-1999; LatestRevisionDate: 29-May-2009; LatestRevisionNote: IPC-7351 Footprint Added.; PackageVersion: Dec-2002; PackageReference: SO8; PackageDescription: 8-Pin Small Outline Integrated Circuit 1.27 mm Pitch; Code_JEDEC: MS-012-AA; Code_IPC: SOIC127P600-8
S13-14 = SW-SPDT: as S1-2 on sheet 02-PowerSupply; Published: 24-Mar-1999; LatestRevisionDate: 17-Dec-2003; LatestRevisionNote: Schematic revised, PCB Footprint replaced.; DatasheetVersion: 05-Dec-2000; PackageReference: TL36WW15050; Publisher: Altium Limited; PackageDescription: Switch; 4 Leads; ComponentLink1Description: Manufacturer Link; ComponentLink1URL: http://www.apem.com
U1-14 U2-14 U3-14 U4-14 = SN74LS192N: Synchronous 4-Bit Up/Down Counter (Dual Clock with Clear); ComponentAvailability: Obsolete; Published: 8-Jun-2000; LatestRevisionDate: 04-Mar-2005; LatestRevisionNote: Stylized 3D Model Added.; DatasheetVersion: Mar-1988; PackageVersion: Oct-1995; PackageReference: N016D; Publisher: Altium Limited; PackageDescription: DIP; 16 Leads; Row Spacing 7.62 mm; Pitch 2.54 mm; Code_JEDEC: MS-001-BB; ComponentLink1Description: Manufacturer Link; ComponentLink1URL: http://www.ti.com/; ComponentLink2Description: Datasheet; ComponentLink2URL: http://www-s.ti.com/sc/ds/sn74ls192.pdf

## Sheet 15-DistanceSRF05.SchDoc
size A4; DocumentNumber: 15; SheetNumber: 15; SheetTotal: 26
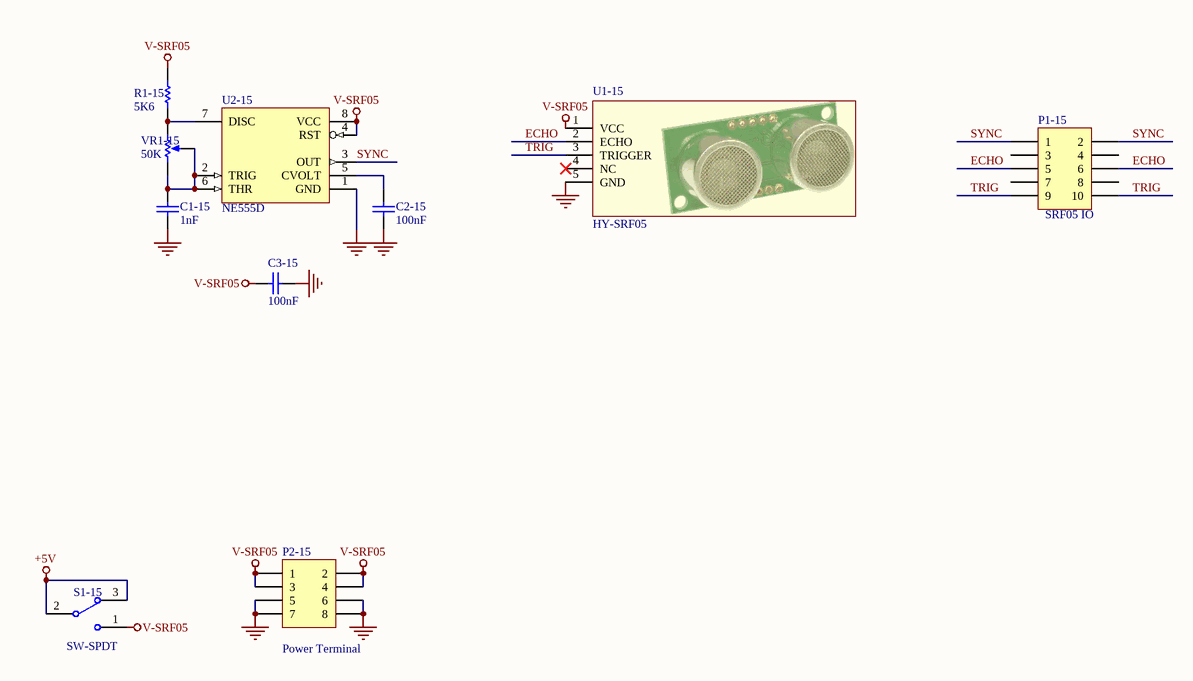
[diagram p21: 15-DistanceSRF05.SchDoc]

### Parts
C1-15  value 1nF  [c-0805]  (hidden comment: 102)
C2-15  value 100nF  [c-0805]  (hidden comment: 104)
C3-15  value 100nF  [c-0805]  (hidden comment: 104)
P1-15  value SRF05 IO  [JP2.54-F-2x05A]  (hidden comment: Header 5X2)
P2-15  Publisher: Power Terminal  [JP2.54-F-2x04A]  (hidden comment: Header 4X2)
R1-15  value 5K6  [R-0805]  (hidden comment: 562)
S1-15  SW-SPDT  [SW-SLIDE-2P-2W]
U1-15  HY-SRF05  [MDL-SRF05A]
U2-15  NE555D  [SOIC-8]
VR1-15  50K  [VR-3362P]

### Nets
+5V: S1-15.2 S1-15.3
GND: C1-15.1 C2-15.1 C3-15.1 P2-15.5 P2-15.6 P2-15.7 P2-15.8 U1-15.5(GND) U2-15.1(GND)
V-SRF05: C3-15.2 P2-15.1 P2-15.2 P2-15.3 P2-15.4 R1-15.2 S1-15.1 U1-15.1(VCC) U2-15.4(RST) U2-15.8(VCC)
ECHO: P1-15.5 P1-15.6 U1-15.2(ECHO)
SYNC: P1-15.1 P1-15.2 U2-15.3(OUT)
TRIG: P1-15.9 P1-15.10 U1-15.3(TRIGGER)
NetC1-15_2: C1-15.2 U2-15.2(TRIG) U2-15.6(THR) VR1-15.1(TOP) VR1-15.2(TAP)
NetC2-15_2: C2-15.2 U2-15.5(CVOLT)
NetR1-15_1: R1-15.1 U2-15.7(DISC) VR1-15.3(BOT)

Not connected (* = marked no-connect by the designer): P1-15 3 4 7 8; U1-15 4(NC)*

### Library data of the parts
C1-15 C2-15 C3-15 = Cap: Capacitor; Published: 8-Jun-2000; LatestRevisionDate: 17-Jul-2002; LatestRevisionNote: Re-released for DXP Platform.; PackageReference: RAD-0.3; Publisher: Altium Limited
P1-15 = Header 5X2: Header, 5-Pin, Dual row; LatestRevisionDate: 17-Jul-2002; LatestRevisionNote: Re-released for DXP Platform.
P2-15 = Header 4X2: Header, 4-Pin, Dual row; LatestRevisionDate: 17-Jul-2002; LatestRevisionNote: Re-released for DXP Platform.
R1-15 = Res1: Resistor; Published: 8-Jun-2000; LatestRevisionDate: 17-Jul-2002; LatestRevisionNote: Re-released for DXP Platform.; PackageReference: AXIAL-0.3; Publisher: Altium Limited
S1-15 = SW-SPDT: SPDT Subminiature Toggle Switch, Right Angle Mounting, Vertical Actuation; Published: 24-Mar-1999; LatestRevisionDate: 17-Dec-2003; LatestRevisionNote: Schematic revised, PCB Footprint replaced.; DatasheetVersion: 05-Dec-2000; PackageReference: TL36WW15050; Publisher: Altium Limited; PackageDescription: Switch; 4 Leads; ComponentLink1Description: Manufacturer Link; ComponentLink1URL: http://www.apem.com
U2-15 = NE555D: General-Purpose Single Bipolar Timer; Published: 24-Aug-2001; LatestRevisionDate: 13-Apr-2006; LatestRevisionNote: IPC-7351 Footprint Added.; DatasheetVersion: Jul-1998; PackageVersion: Dec-2002; PackageReference: SO8; Publisher: Altium Limited; PackageDescription: 8-Pin Small Outline Integrated Circuit 1.27 mm Pitch; Code_JEDEC: MS-012-AA; Code_IPC: SOIC127P600-8; ComponentLink1Description: Manufacturer Link; ComponentLink1URL: http://www.st.com/; ComponentLink2Description: Datasheet; ComponentLink2URL: http://www.st.com/stonline/products/literature/ds/2182/ne555.pdf
VR1-15 = RPot: Potentiometer; Sim Note: Enter the Resistance value and the set point into parameter fields.; Set Position: 0.5; Published: 8-Jun-2000; LatestRevisionDate: 17-Jul-2002; LatestRevisionNote: Re-released for DXP Platform.; PackageReference: VR5; Publisher: Altium Limited; Value: 50K

## Sheet 16-BitSW.SchDoc
size A4; DocumentNumber: 16; SheetNumber: 16; SheetTotal: 26
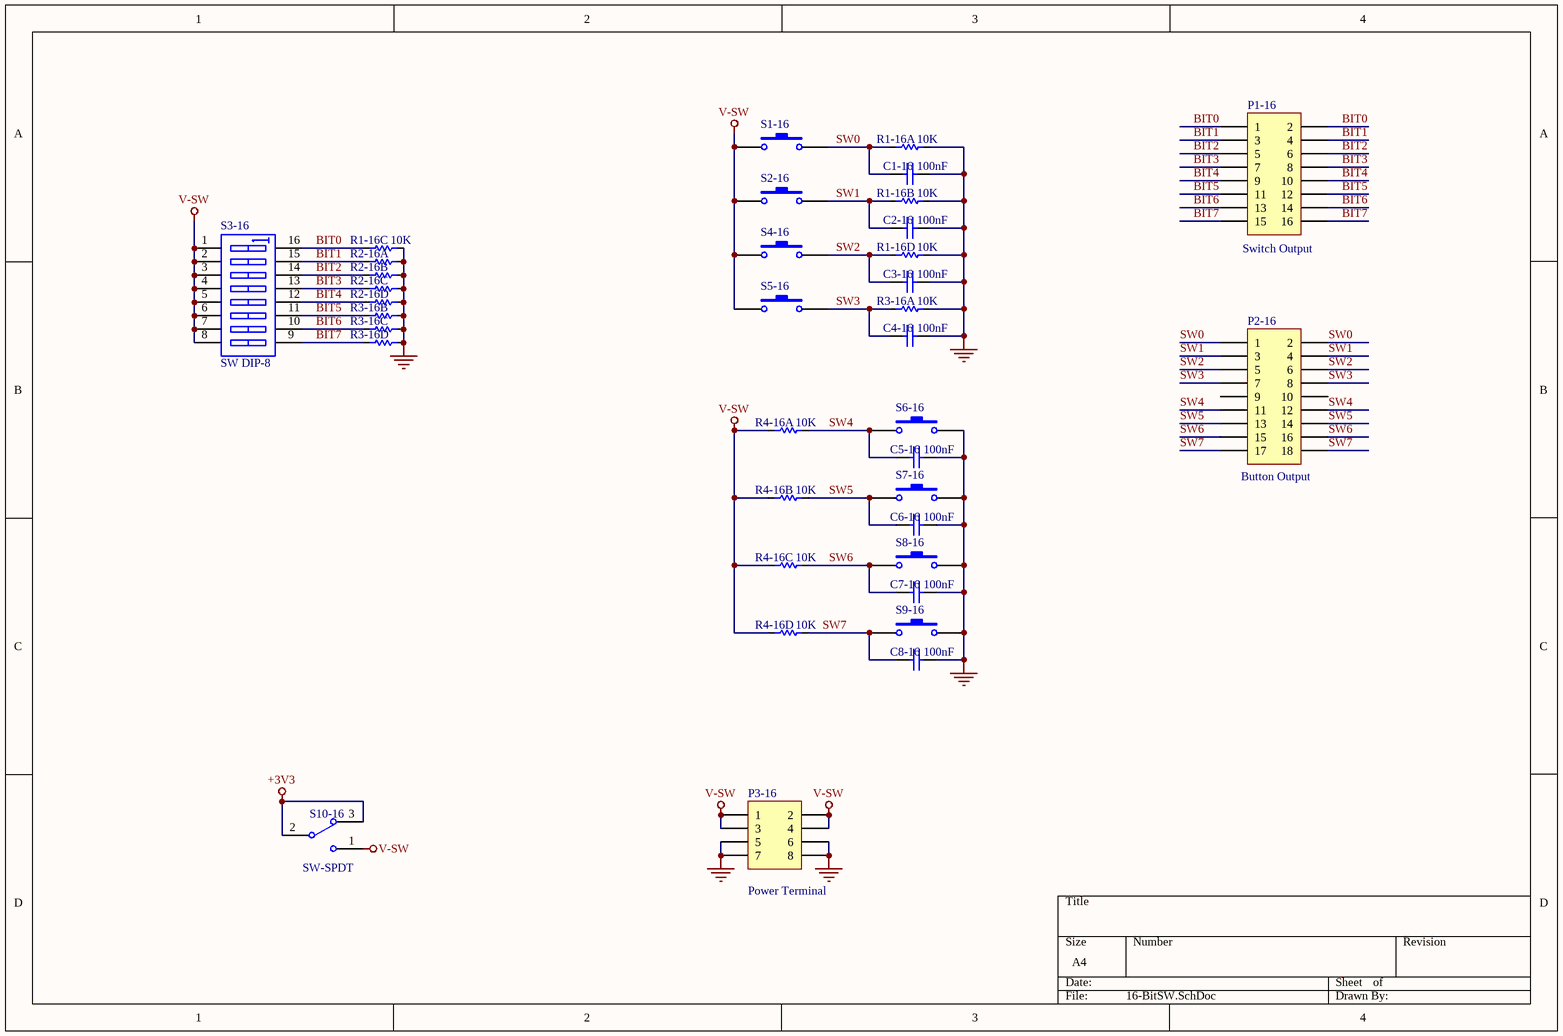
[diagram p22: 16-BitSW.SchDoc]

### Parts
C1-16  value 100nF  [c-0805]  (hidden comment: 104)
C2-16  value 100nF  [c-0805]  (hidden comment: 104)
C3-16  value 100nF  [c-0805]  (hidden comment: 104)
C4-16  value 100nF  [c-0805]  (hidden comment: 104)
C5-16  value 100nF  [c-0805]  (hidden comment: 104)
C6-16  value 100nF  [c-0805]  (hidden comment: 104)
C7-16  value 100nF  [c-0805]  (hidden comment: 104)
C8-16  value 100nF  [c-0805]  (hidden comment: 104)
P1-16  value Switch Output  [JP2.54-F-2x08A]  (hidden comment: Header 8X2)
P2-16  value Button Output  [JP2.54-F-2x09A]  (hidden comment: Header 9X2)
P3-16  Publisher: Power Terminal  [JP2.54-F-2x04A]  (hidden comment: Header 4X2)
R1-16  value 10K  [R-Array-0603-4]  (hidden comment: 103)  (parts A,B,C,D of 4)
R2-16  103  [R-Array-0603-4]  (value not drawn)  (parts A,B,C,D of 4)
R3-16  value 10K  [R-Array-0603-4]  (hidden comment: 103)  (parts A,B,C,D of 4)
R4-16  value 10K  [R-Array-0603-4]  (hidden comment: 103)  (parts A,B,C,D of 4)
S1-16  SW-S6  [SW-T-S6-SMD]  (value not drawn)
S2-16  SW-S6  [SW-T-S6-SMD]  (value not drawn)
S3-16  SW DIP-8  [SW-DIP8]
S4-16  SW-S6  [SW-T-S6-SMD]  (value not drawn)
S5-16  SW-S6  [SW-T-S6-SMD]  (value not drawn)
S6-16  SW-S6  [SW-T-S6-SMD]  (value not drawn)
S7-16  SW-S6  [SW-T-S6-SMD]  (value not drawn)
S8-16  SW-S6  [SW-T-S6-SMD]  (value not drawn)
S9-16  SW-S6  [SW-T-S6-SMD]  (value not drawn)
S10-16  SW-SPDT  [SW-SLIDE-2P-2W]

### Nets
+3V3: S10-16.2 S10-16.3
GND: C1-16.1 C2-16.1 C3-16.1 C4-16.1 C5-16.1 C6-16.1 C7-16.1 C8-16.1 P3-16.5 P3-16.6 P3-16.7 P3-16.8 R1-16.2 R1-16.4 R1-16.6 R1-16.8 R2-16.2 R2-16.4 R2-16.6 R2-16.8 R3-16.2 R3-16.4 R3-16.6 R3-16.8 S6-16.2 S7-16.2 S8-16.2 S9-16.2
V-SW: P3-16.1 P3-16.2 P3-16.3 P3-16.4 R4-16.1 R4-16.3 R4-16.5 R4-16.7 S1-16.1 S2-16.1 S3-16.1(A1) S3-16.2(A2) S3-16.3(A3) S3-16.4(A4) S3-16.5(A5) S3-16.6(A6) S3-16.7(A7) S3-16.8(A8) S4-16.1 S5-16.1 S10-16.1
BIT0: P1-16.1 P1-16.2 R1-16.5 S3-16.16(B1)
BIT1: P1-16.3 P1-16.4 R2-16.1 S3-16.15(B2)
BIT2: P1-16.5 P1-16.6 R2-16.3 S3-16.14(B3)
BIT3: P1-16.7 P1-16.8 R2-16.5 S3-16.13(B4)
BIT4: P1-16.9 P1-16.10 R2-16.7 S3-16.12(B5)
BIT5: P1-16.11 P1-16.12 R3-16.3 S3-16.11(B6)
BIT6: P1-16.13 P1-16.14 R3-16.5 S3-16.10(B7)
BIT7: P1-16.15 P1-16.16 R3-16.7 S3-16.9(B8)
SW0: C1-16.2 P2-16.1 P2-16.2 R1-16.1 S1-16.2
SW1: C2-16.2 P2-16.3 P2-16.4 R1-16.3 S2-16.2
SW2: C3-16.2 P2-16.5 P2-16.6 R1-16.7 S4-16.2
SW3: C4-16.2 P2-16.7 P2-16.8 R3-16.1 S5-16.2
SW4: C5-16.2 P2-16.11 P2-16.12 R4-16.2 S6-16.1
SW5: C6-16.2 P2-16.13 P2-16.14 R4-16.4 S7-16.1
SW6: C7-16.2 P2-16.15 P2-16.16 R4-16.6 S8-16.1
SW7: C8-16.2 P2-16.17 P2-16.18 R4-16.8 S9-16.1

Not connected (* = marked no-connect by the designer): P2-16 9 10

### Library data of the parts
C1-16 C2-16 C3-16 C4-16 C5-16 C6-16 C7-16 C8-16 = Cap: Capacitor; Manufacturer: Generic Components; Class: Passive; Published: 08/06/2000; Publisher: Altium Hobart Technology Centre; SubClass: Capacitor
P1-16 = Header 8X2: Header, 8-Pin, Dual row; LatestRevisionDate: 17-Jul-2002; LatestRevisionNote: Re-released for DXP Platform.
P2-16 = Header 9X2: Header, 9-Pin, Dual row; LatestRevisionDate: 17-Jul-2002; LatestRevisionNote: Re-released for DXP Platform.
P3-16 = Header 4X2: Header, 4-Pin, Dual row; LatestRevisionDate: 17-Jul-2002; LatestRevisionNote: Re-released for DXP Platform.
R1-16 R3-16 R4-16 = R-8P4R: RES ARRAY 4 RES 330 OHM 1206; Manufacturer: Panasonic Electronic Components; Manufacturer Part Number: EXB-38V331JV; Digi-Key Part Number: Y9331TR-ND; Link: http://www.digikey.com/product-detail/en/EXB-38V331JV/Y9331TR-ND/256525
R2-16 = R-8P4R: RES ARRAY 4 RES 330 OHM 1206; Manufacturer: Panasonic Electronic Components; Manufacturer Part Number: EXB-38V331JV; Value: 10K; Digi-Key Part Number: Y9331TR-ND; Link: http://www.digikey.com/product-detail/en/EXB-38V331JV/Y9331TR-ND/256525
S1-16 S2-16 S4-16 S5-16 S6-16 S7-16 S8-16 S9-16 = SW-PB: Switch; Published: 24-Mar-1999; LatestRevisionDate: 17-Jul-2002; LatestRevisionNote: Re-released for DXP Platform.; PackageReference: SPST-2; Publisher: Altium Limited
S3-16 = SW DIP-8: DIP Switch, 8 Position, SPST; Published: 24-Mar-1999; LatestRevisionDate: 17-Jul-2002; LatestRevisionNote: Re-released for DXP Platform.; PackageReference: DIP_SW_8WAY_SMD; Publisher: Altium Limited; PackageDescription: DIP Switch; 16 Leads
S10-16 = SW-SPDT: as S1-15 on sheet 15-DistanceSRF05; Published: 24-Mar-1999; LatestRevisionDate: 17-Dec-2003; LatestRevisionNote: Schematic revised, PCB Footprint replaced.; DatasheetVersion: 05-Dec-2000; PackageReference: TL36WW15050; Publisher: Altium Limited; PackageDescription: Switch; 4 Leads; ComponentLink1Description: Manufacturer Link; ComponentLink1URL: http://www.apem.com

## Sheet 16-BitSWStatusLed.SchDoc
size A4; DocumentNumber: 16; SheetNumber: 16; SheetTotal: 26
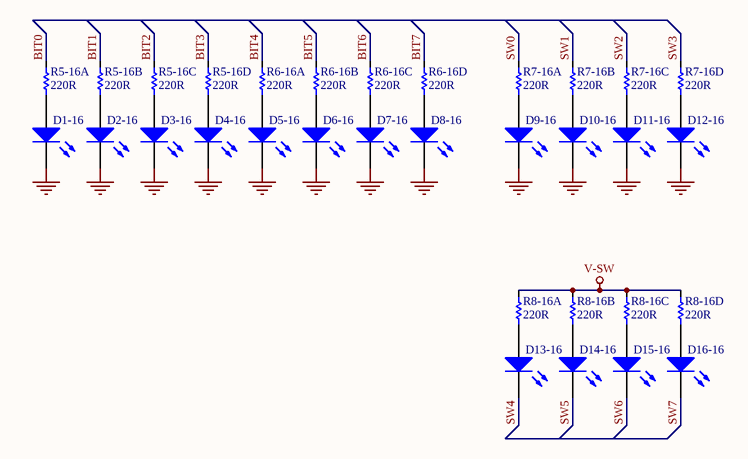
[diagram p23: 16-BitSWStatusLed.SchDoc]

### Parts
D1-16  LED  [LED-0805]  (value not drawn)
D2-16  LED  [LED-0805]  (value not drawn)
D3-16  LED  [LED-0805]  (value not drawn)
D4-16  LED  [LED-0805]  (value not drawn)
D5-16  LED  [LED-0805]  (value not drawn)
D6-16  LED  [LED-0805]  (value not drawn)
D7-16  LED  [LED-0805]  (value not drawn)
D8-16  LED  [LED-0805]  (value not drawn)
D9-16  LED  [LED-0805]  (value not drawn)
D10-16  LED  [LED-0805]  (value not drawn)
D11-16  LED  [LED-0805]  (value not drawn)
D12-16  LED  [LED-0805]  (value not drawn)
D13-16  LED  [LED-0805]  (value not drawn)
D14-16  LED  [LED-0805]  (value not drawn)
D15-16  LED  [LED-0805]  (value not drawn)
D16-16  LED  [LED-0805]  (value not drawn)
R5-16  220R  [R-Array-0603-4]  (parts A,B,C,D of 4)
R6-16  220R  [R-Array-0603-4]  (parts A,B,C,D of 4)
R7-16  220R  [R-Array-0603-4]  (parts A,B,C,D of 4)
R8-16  220R  [R-Array-0603-4]  (parts A,B,C,D of 4)

### Nets
GND: D1-16.2(K) D2-16.2(K) D3-16.2(K) D4-16.2(K) D5-16.2(K) D6-16.2(K) D7-16.2(K) D8-16.2(K) D9-16.2(K) D10-16.2(K) D11-16.2(K) D12-16.2(K)
V-SW: R8-16.2 R8-16.4 R8-16.6 R8-16.8
BIT0: R5-16.2
BIT1: R5-16.4
BIT2: R5-16.6
BIT3: R5-16.8
BIT4: R6-16.2
BIT5: R6-16.4
BIT6: R6-16.6
BIT7: R6-16.8
SW0: R7-16.2
SW1: R7-16.4
SW2: R7-16.6
SW3: R7-16.8
SW4: D13-16.2(K)
SW5: D14-16.2(K)
SW6: D15-16.2(K)
SW7: D16-16.2(K)
NetD1-16_1: D1-16.1(A) R5-16.1
NetD2-16_1: D2-16.1(A) R5-16.3
NetD3-16_1: D3-16.1(A) R5-16.5
NetD4-16_1: D4-16.1(A) R5-16.7
NetD5-16_1: D5-16.1(A) R6-16.1
NetD6-16_1: D6-16.1(A) R6-16.3
NetD7-16_1: D7-16.1(A) R6-16.5
NetD8-16_1: D8-16.1(A) R6-16.7
NetD9-16_1: D9-16.1(A) R7-16.1
NetD10-16_1: D10-16.1(A) R7-16.3
NetD11-16_1: D11-16.1(A) R7-16.5
NetD12-16_1: D12-16.1(A) R7-16.7
NetD13-16_1: D13-16.1(A) R8-16.1
NetD14-16_1: D14-16.1(A) R8-16.3
NetD15-16_1: D15-16.1(A) R8-16.5
NetD16-16_1: D16-16.1(A) R8-16.7

### Library data of the parts
D1-16 D2-16 D3-16 D4-16 D5-16 D6-16 D7-16 D8-16 D9-16 D10-16 D11-16 D12-16 D13-16 D14-16 D15-16 D16-16 = LED2: Typical RED, GREEN, YELLOW, AMBER GaAs LED; Published: 8-Jun-2000; LatestRevisionDate: 17-Jul-2002; LatestRevisionNote: Re-released for DXP Platform.; PackageVersion: Feb-2002; PackageReference: 3.2X1.6X1.1; Publisher: Altium Limited; PackageDescription: SM LED; 2 Flat Leads
R5-16 R6-16 R7-16 R8-16 = R-8P4R: as R1-16 on sheet 16-BitSW; Digi-Key Part Number: Y9331TR-ND; Link: http://www.digikey.com/product-detail/en/EXB-38V331JV/Y9331TR-ND/256525; Value: 220R

## Sheet 17-Led.SchDoc
size A4; DocumentNumber: 17; SheetNumber: 17; SheetTotal: 26
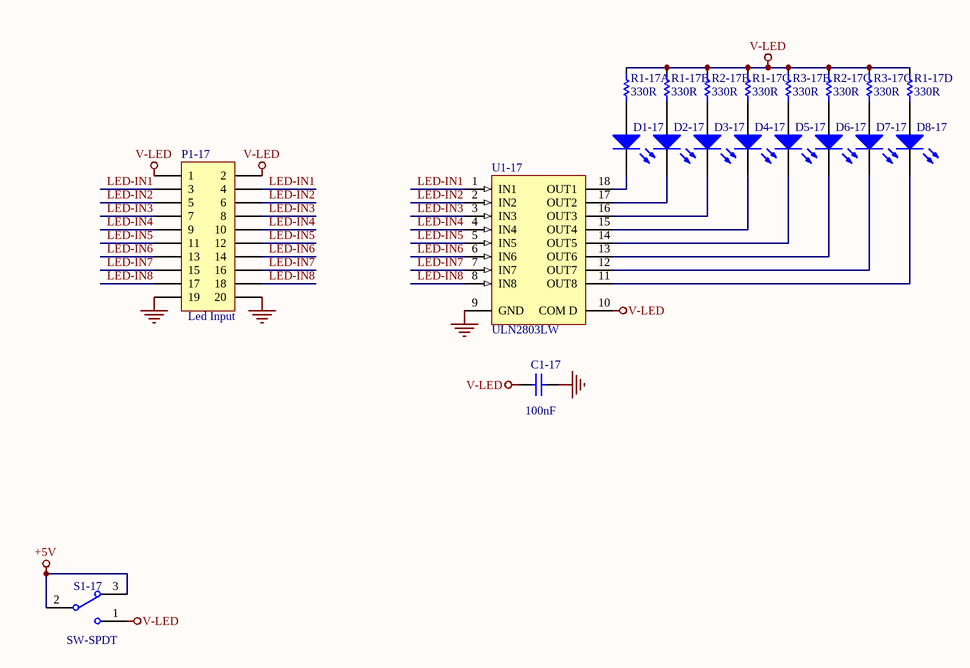
[diagram p24: 17-Led.SchDoc]

### Parts
C1-17  value 100nF  [c-0805]  (hidden comment: 104)
D1-17  LED  [LED-0805]  (value not drawn)
D2-17  LED  [LED-0805]  (value not drawn)
D3-17  LED  [LED-0805]  (value not drawn)
D4-17  LED  [LED-0805]  (value not drawn)
D5-17  LED  [LED-0805]  (value not drawn)
D6-17  LED  [LED-0805]  (value not drawn)
D7-17  LED  [LED-0805]  (value not drawn)
D8-17  LED  [LED-0805]  (value not drawn)
P1-17  value Led Input  [JP2.54-F-2x10A]  (hidden comment: H10X2)
R1-17  330R  [R-Array-0603-4]  (parts A,B,C,D of 4)
R2-17  330R  [R-Array-0603-4]  (parts B,C of 4)
R3-17  330R  [R-Array-0603-4]  (parts B,C of 4)
S1-17  SW-SPDT  [SW-SLIDE-2P-2W]
U1-17  ULN2803LW  [SOIC-18-W]

### Nets
+5V: S1-17.2 S1-17.3
GND: C1-17.2 P1-17.19 P1-17.20 U1-17.9(GND)
V-LED: C1-17.1 P1-17.1 P1-17.2 R1-17.2 R1-17.4 R1-17.6 R1-17.8 R2-17.4 R2-17.6 R3-17.4 R3-17.6 S1-17.1 U1-17.10(COM_D)
LED-IN1: P1-17.3 P1-17.4 U1-17.1(IN1)
LED-IN2: P1-17.5 P1-17.6 U1-17.2(IN2)
LED-IN3: P1-17.7 P1-17.8 U1-17.3(IN3)
LED-IN4: P1-17.9 P1-17.10 U1-17.4(IN4)
LED-IN5: P1-17.11 P1-17.12 U1-17.5(IN5)
LED-IN6: P1-17.13 P1-17.14 U1-17.6(IN6)
LED-IN7: P1-17.15 P1-17.16 U1-17.7(IN7)
LED-IN8: P1-17.17 P1-17.18 U1-17.8(IN8)
NetD1-17_1: D1-17.1(A) R1-17.1
NetD1-17_2: D1-17.2(K) U1-17.18(OUT1)
NetD2-17_1: D2-17.1(A) R1-17.3
NetD2-17_2: D2-17.2(K) U1-17.17(OUT2)
NetD3-17_1: D3-17.1(A) R2-17.3
NetD3-17_2: D3-17.2(K) U1-17.16(OUT3)
NetD4-17_1: D4-17.1(A) R1-17.5
NetD4-17_2: D4-17.2(K) U1-17.15(OUT4)
NetD5-17_1: D5-17.1(A) R3-17.3
NetD5-17_2: D5-17.2(K) U1-17.14(OUT5)
NetD6-17_1: D6-17.1(A) R2-17.5
NetD6-17_2: D6-17.2(K) U1-17.13(OUT6)
NetD7-17_1: D7-17.1(A) R3-17.5
NetD7-17_2: D7-17.2(K) U1-17.12(OUT7)
NetD8-17_1: D8-17.1(A) R1-17.7
NetD8-17_2: D8-17.2(K) U1-17.11(OUT8)

### Library data of the parts
C1-17 = Cap: Capacitor; Published: 8-Jun-2000; LatestRevisionDate: 17-Jul-2002; LatestRevisionNote: Re-released for DXP Platform.; PackageReference: RAD-0.3; Publisher: Altium Limited; PackageDescription: Radial Cap, Thru-Hole; 2 Leads; 0.3 in Pin Spacing
D1-17 D2-17 D3-17 D4-17 D5-17 D6-17 D7-17 D8-17 = LED2: as D1-16 on sheet 16-BitSWStatusLed; Published: 8-Jun-2000; LatestRevisionDate: 17-Jul-2002; LatestRevisionNote: Re-released for DXP Platform.; PackageVersion: Feb-2002; PackageReference: 3.2X1.6X1.1; Publisher: Altium Limited; PackageDescription: SM LED; 2 Flat Leads
P1-17 = Header 10X2: Header, 10-Pin, Dual row; LatestRevisionDate: 17-Jul-2002; LatestRevisionNote: Re-released for DXP Platform.
R1-17 R2-17 R3-17 = R-8P4R: as R1-16 on sheet 16-BitSW; Digi-Key Part Number: Y9331TR-ND; Link: http://www.digikey.com/product-detail/en/EXB-38V331JV/Y9331TR-ND/256525
S1-17 = SW-SPDT: as S1-15 on sheet 15-DistanceSRF05; Published: 24-Mar-1999; LatestRevisionDate: 17-Dec-2003; LatestRevisionNote: Schematic revised, PCB Footprint replaced.; DatasheetVersion: 05-Dec-2000; PackageReference: TL36WW15050; Publisher: Altium Limited; PackageDescription: Switch; 4 Leads; ComponentLink1Description: Manufacturer Link; ComponentLink1URL: http://www.apem.com
U1-17 = ULN2803LW: High-Voltage, High-Current Darlington Array; Published: 13-Oct-2000; LatestRevisionDate: 13-Apr-2006; LatestRevisionNote: IPC-7351 Footprint Added.; DatasheetVersion: 1999; PackageReference: LW18; Publisher: Altium Limited; PackageDescription: 18-Pin Small Outline Integrated Circuit 1.27 mm Pitch; Code_JEDEC: MS-013-AB; ComponentLink1Description: Manufacturer Link; ComponentLink1URL: http://www.allegromicro.com/

## Sheet 19-CPLD.SchDoc
size A4; DocumentNumber: 18; SheetNumber: 19; SheetTotal: 26
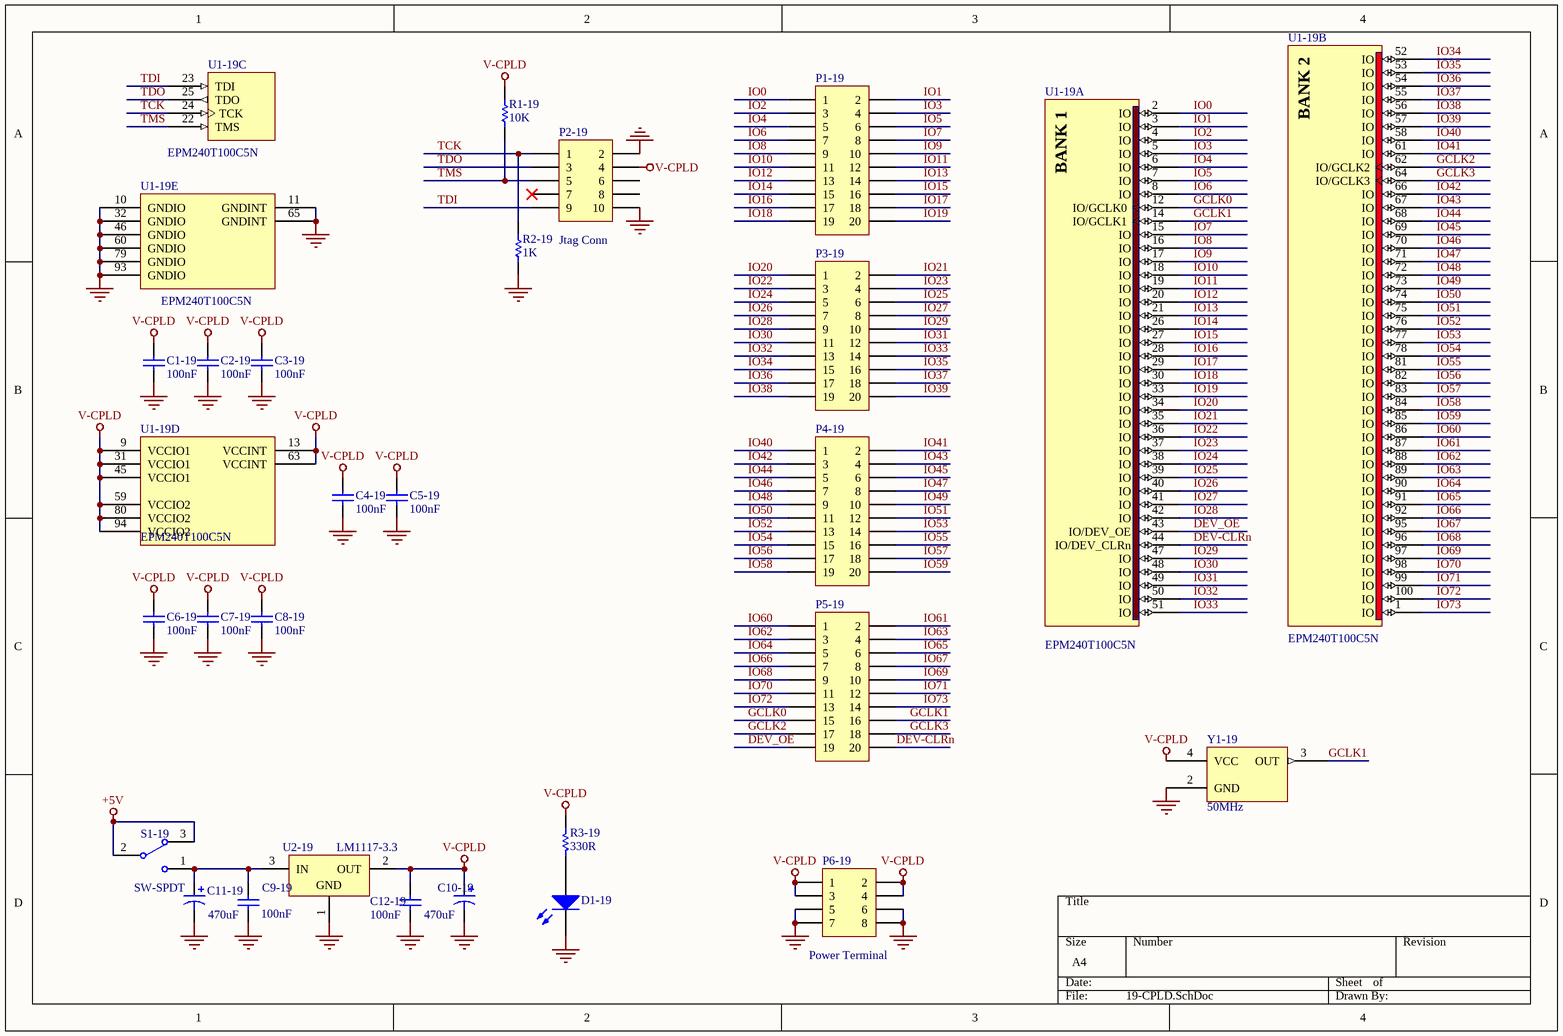
[diagram p25: 19-CPLD.SchDoc]

### Parts
C1-19  value 100nF  [c-0805]  (hidden comment: 104)
C2-19  value 100nF  [c-0805]  (hidden comment: 104)
C3-19  value 100nF  [c-0805]  (hidden comment: 104)
C4-19  value 100nF  [c-0805]  (hidden comment: 104)
C5-19  value 100nF  [c-0805]  (hidden comment: 104)
C6-19  value 100nF  [c-0805]  (hidden comment: 104)
C7-19  value 100nF  [c-0805]  (hidden comment: 104)
C8-19  value 100nF  [c-0805]  (hidden comment: 104)
C9-19  value 100nF  [c-0805]  (hidden comment: 104)
C10-19  value 470uF  [C-ALU-10x10mm]  (hidden comment: 470uF/16V)
C11-19  value 470uF  [C-ALU-10x10mm]  (hidden comment: 470uF/16V)
C12-19  value 100nF  [c-0805]  (hidden comment: 104)
D1-19  LED  [LED-0805]  (value not drawn)
P1-19  H2  [HDR2X10]  (value not drawn)
P2-19  value Jtag Conn  [CONN-IDC-5X2-A]  (hidden comment: IDE5x2)
P3-19  H2  [HDR2X10]  (value not drawn)
P4-19  H2  [HDR2X10]  (value not drawn)
P5-19  H2  [HDR2X10]  (value not drawn)
P6-19  Publisher: Power Terminal  [JP2.54-F-2x04A]  (hidden comment: Header 4X2)
R1-19  10K  [R-0805]
R2-19  1K  [R-0805]
R3-19  value 330R  [R-0805]  (hidden comment: 331)
S1-19  SW-SPDT  [SW-SLIDE-2P-2W]
U1-19  EPM240T100C5N  [TQFP-100]  (parts A,B,C,D,E of 5)
U2-19  LM1117-3.3  [SOT-223-3]
Y1-19  50MHz  [XTAL-SMD5070]

### Nets
+5V: S1-19.2 S1-19.3
GND: C1-19.2 C2-19.2 C3-19.2 C4-19.2 C5-19.2 C6-19.2 C7-19.2 C8-19.2 C9-19.1 C10-19.2 C11-19.2 C12-19.1 D1-19.2(K) P2-19.2 P2-19.10 P6-19.5 P6-19.6 P6-19.7 P6-19.8 R2-19.2 U1-19.10(GNDIO) U1-19.11(GNDINT) U1-19.32(GNDIO) U1-19.46(GNDIO) U1-19.60(GNDIO) U1-19.65(GNDINT) U1-19.79(GNDIO) U1-19.93(GNDIO) U2-19.1(GND) Y1-19.2(GND)
V-CPLD: C1-19.1 C2-19.1 C3-19.1 C4-19.1 C5-19.1 C6-19.1 C7-19.1 C8-19.1 C10-19.1 C12-19.2 P2-19.4 P6-19.1 P6-19.2 P6-19.3 P6-19.4 R1-19.1 R3-19.1 U1-19.9(VCCIO1) U1-19.13(VCCINT) U1-19.31(VCCIO1) U1-19.45(VCCIO1) U1-19.59(VCCIO2) U1-19.63(VCCINT) U1-19.80(VCCIO2) U1-19.94(VCCIO2) U2-19.2(OUT) Y1-19.4(VCC)
DEV-CLRn: P5-19.20 U1-19.44(IO/DEV_CLRn)
DEV_OE: P5-19.19 U1-19.43(IO/DEV_OE)
GCLK0: P5-19.15 U1-19.12(IO/GCLK0)
GCLK1: P5-19.16 U1-19.14(IO/GCLK1) Y1-19.3(OUT)
GCLK2: P5-19.17 U1-19.62(IO/GCLK2)
GCLK3: P5-19.18 U1-19.64(IO/GCLK3)
IO0: P1-19.1 U1-19.2(IO)
IO1: P1-19.2 U1-19.3(IO)
IO2: P1-19.3 U1-19.4(IO)
IO3: P1-19.4 U1-19.5(IO)
IO4: P1-19.5 U1-19.6(IO)
IO5: P1-19.6 U1-19.7(IO)
IO6: P1-19.7 U1-19.8(IO)
IO7: P1-19.8 U1-19.15(IO)
IO8: P1-19.9 U1-19.16(IO)
IO9: P1-19.10 U1-19.17(IO)
IO10: P1-19.11 U1-19.18(IO)
IO11: P1-19.12 U1-19.19(IO)
IO12: P1-19.13 U1-19.20(IO)
IO13: P1-19.14 U1-19.21(IO)
IO14: P1-19.15 U1-19.26(IO)
IO15: P1-19.16 U1-19.27(IO)
IO16: P1-19.17 U1-19.28(IO)
IO17: P1-19.18 U1-19.29(IO)
IO18: P1-19.19 U1-19.30(IO)
IO19: P1-19.20 U1-19.33(IO)
IO20: P3-19.1 U1-19.34(IO)
IO21: P3-19.2 U1-19.35(IO)
IO22: P3-19.3 U1-19.36(IO)
IO23: P3-19.4 U1-19.37(IO)
IO24: P3-19.5 U1-19.38(IO)
IO25: P3-19.6 U1-19.39(IO)
IO26: P3-19.7 U1-19.40(IO)
IO27: P3-19.8 U1-19.41(IO)
IO28: P3-19.9 U1-19.42(IO)
IO29: P3-19.10 U1-19.47(IO)
IO30: P3-19.11 U1-19.48(IO)
IO31: P3-19.12 U1-19.49(IO)
IO32: P3-19.13 U1-19.50(IO)
IO33: P3-19.14 U1-19.51(IO)
IO34: P3-19.15 U1-19.52(IO)
IO35: P3-19.16 U1-19.53(IO)
IO36: P3-19.17 U1-19.54(IO)
IO37: P3-19.18 U1-19.55(IO)
IO38: P3-19.19 U1-19.56(IO)
IO39: P3-19.20 U1-19.57(IO)
IO40: P4-19.1 U1-19.58(IO)
IO41: P4-19.2 U1-19.61(IO)
IO42: P4-19.3 U1-19.66(IO)
IO43: P4-19.4 U1-19.67(IO)
IO44: P4-19.5 U1-19.68(IO)
IO45: P4-19.6 U1-19.69(IO)
IO46: P4-19.7 U1-19.70(IO)
IO47: P4-19.8 U1-19.71(IO)
IO48: P4-19.9 U1-19.72(IO)
IO49: P4-19.10 U1-19.73(IO)
IO50: P4-19.11 U1-19.74(IO)
IO51: P4-19.12 U1-19.75(IO)
IO52: P4-19.13 U1-19.76(IO)
IO53: P4-19.14 U1-19.77(IO)
IO54: P4-19.15 U1-19.78(IO)
IO55: P4-19.16 U1-19.81(IO)
IO56: P4-19.17 U1-19.82(IO)
IO57: P4-19.18 U1-19.83(IO)
IO58: P4-19.19 U1-19.84(IO)
IO59: P4-19.20 U1-19.85(IO)
IO60: P5-19.1 U1-19.86(IO)
IO61: P5-19.2 U1-19.87(IO)
IO62: P5-19.3 U1-19.88(IO)
IO63: P5-19.4 U1-19.89(IO)
IO64: P5-19.5 U1-19.90(IO)
IO65: P5-19.6 U1-19.91(IO)
IO66: P5-19.7 U1-19.92(IO)
IO67: P5-19.8 U1-19.95(IO)
IO68: P5-19.9 U1-19.96(IO)
IO69: P5-19.10 U1-19.97(IO)
IO70: P5-19.11 U1-19.98(IO)
IO71: P5-19.12 U1-19.99(IO)
IO72: P5-19.13 U1-19.100(IO)
IO73: P5-19.14 U1-19.1(IO)
TCK: P2-19.1 R2-19.1 U1-19.24(TCK)
TDI: P2-19.9 U1-19.23(TDI)
TDO: P2-19.3 U1-19.25(TDO)
TMS: P2-19.5 R1-19.2 U1-19.22(TMS)
NetC9-19_2: C9-19.2 C11-19.1 S1-19.1 U2-19.3(IN)
NetD1-19_1: D1-19.1(A) R3-19.2

Not connected (* = marked no-connect by the designer): P2-19 6 7* 8; Y1-19 1(NC)

### Notes on the sheet
- (in symbol EPM240T100C5N, part A) BANK 1
- (in symbol EPM240T100C5N, part B) BANK 2

### Library data of the parts
C1-19 C2-19 C3-19 C4-19 C5-19 C6-19 C7-19 C8-19 = Cap: Capacitor; Published: 8-Jun-2000; LatestRevisionDate: 17-Jul-2002; LatestRevisionNote: Re-released for DXP Platform.; PackageReference: RAD-0.3; Publisher: Altium Limited; PackageDescription: Radial Cap, Thru-Hole; 2 Leads; 0.3 in Pin Spacing
C9-19 C12-19 = Cap: as C1-16 on sheet 16-BitSW; Published: 08/06/2000; Publisher: Altium Hobart Technology Centre; SubClass: Capacitor
C10-19 C11-19 = Cap Pol1: Polarized Capacitor (Radial); Published: 8-Jun-2000; LatestRevisionDate: 17-Jul-2002; LatestRevisionNote: Re-released for DXP Platform.; PackageReference: RB7.6-15; Publisher: Altium Limited
D1-19 = LED0: Typical INFRARED GaAs LED; Published: 8-Jun-2000; LatestRevisionDate: 08-Jul-2005; LatestRevisionNote: Mech Layer 1 removed.; PackageReference: LED-0; Publisher: Altium Limited; Value: LED
P1-19 P3-19 P4-19 P5-19 = Header 10X2: Header, 10-Pin, Dual row; Value: IO; LatestRevisionDate: 17-Jul-2002; LatestRevisionNote: Re-released for DXP Platform.
P2-19 = Header 5X2: Header, 5-Pin, Dual row; LatestRevisionDate: 17-Jul-2002; LatestRevisionNote: Re-released for DXP Platform.
P6-19 = Header 4X2: Header, 4-Pin, Dual row; LatestRevisionDate: 17-Jul-2002; LatestRevisionNote: Re-released for DXP Platform.
R1-19 R2-19 R3-19 = Res1: Resistor; Published: 8-Jun-2000; LatestRevisionDate: 17-Jul-2002; LatestRevisionNote: Re-released for DXP Platform.; PackageReference: AXIAL-0.3; Publisher: Altium Limited
  R1-19: Value: 10K
  R2-19: Value: 1K
S1-19 = SW-SPDT: as S1-15 on sheet 15-DistanceSRF05; Published: 24-Mar-1999; LatestRevisionDate: 17-Dec-2003; LatestRevisionNote: Schematic revised, PCB Footprint replaced.; DatasheetVersion: 05-Dec-2000; PackageReference: TL36WW15050; Publisher: Altium Limited; PackageDescription: Switch; 4 Leads; ComponentLink1Description: Manufacturer Link; ComponentLink1URL: http://www.apem.com
U1-19 = EPM240T100C5N: MAX II 3.3/2.5V CPLD, 80 IOs, 240 Logic Elements, 100-Pin Plastic TQFP, Commercial Temperature, Speed Grade 5, Pb-Free; Note: Each set of VCCIO pins can be connected to 3.3V, 2.5V, 1.8V, or 1.5V.; Note: All VCCINT pins must be connected to either 3.3V or 2.5V (but not a combination of both).; Published: 4-Mar-2005; LatestRevisionDate: 13-Apr-2006; LatestRevisionNote: IPC-7351 Footprint Added.; DatasheetVersion: ver1.8, Jul-2006; PackageVersion: ver15.1, May-2008; PackageReference: TQFP100; Publisher: Altium Limited; PackageDescription: 100-Pin Plastic Thin Quad Flat Pack (TQFP100) - Wire Bond; Supplier 1: Digi-Key; Supplier Part Number 1: 544-1964-ND; Supplier 2: Farnell; Supplier Part Number 2: 1662268; Supplier 3: Farnell; Supplier Part Number 3: 1453503; Code_JEDEC: MS-026-AED; ComponentLink1Description: Manufacturer Link; ComponentLink1URL: http://www.altera.com/products/devices/cpld/max2/mx2-index.jsp; ComponentLink2Description: Handbook; ComponentLink2URL: http://www.altera.com/literature/hb/max2/max2_mii5v1.pdf; ComponentLink3Description: Packaging Specification; ComponentLink3URL: http://www.altera.com/literature/ds/dspkg.pdf
U2-19 = LM1117IDTX-3.3: 800mA Low-Dropout Linear Regulator, 3-pin TO-252; Manufacturer: National Semiconductor; PackageTopMarking: NSUZXYTT*LM1117*IDT-3.3; PowerWise: N; CompType: LDO IC; Published: 1-Mar-2010; DatasheetVersion: Apr-2006; PackageVersion: revD, Feb-2009; PackageReference: TD03B; Publisher: Altium Limited; PackageDescription: TO252, Molded, Jedec, 6.8 x 6.10 x 2.30mm Body, 3 Lead, 2.28mm Pitch, Surface Mount; PartNumber: LM1117IDTX-3.3; Value: LM1117-3.3; PinCount: 3; Code_JEDEC: TO-252-AA; ComponentLink1Description: LM1117 Datasheet; ComponentLink1URL: http://www.national.com/ds/LM/LM1117.pdf; ComponentLink2Description: LM1117 Web Page; ComponentLink2URL: http://www.national.com/pf/LM/LM1117.html; ComponentLink3Description: TD03B Package Page; ComponentLink3URL: http://www.national.com/packaging/folders/td03b.html
Y1-19 = OSC: XTAL 50MHz, 4pin; Value: 50MHz